# EAGLE design sensor (EAGLE 9.6.2)

## Sheet 1 of 3: COVER
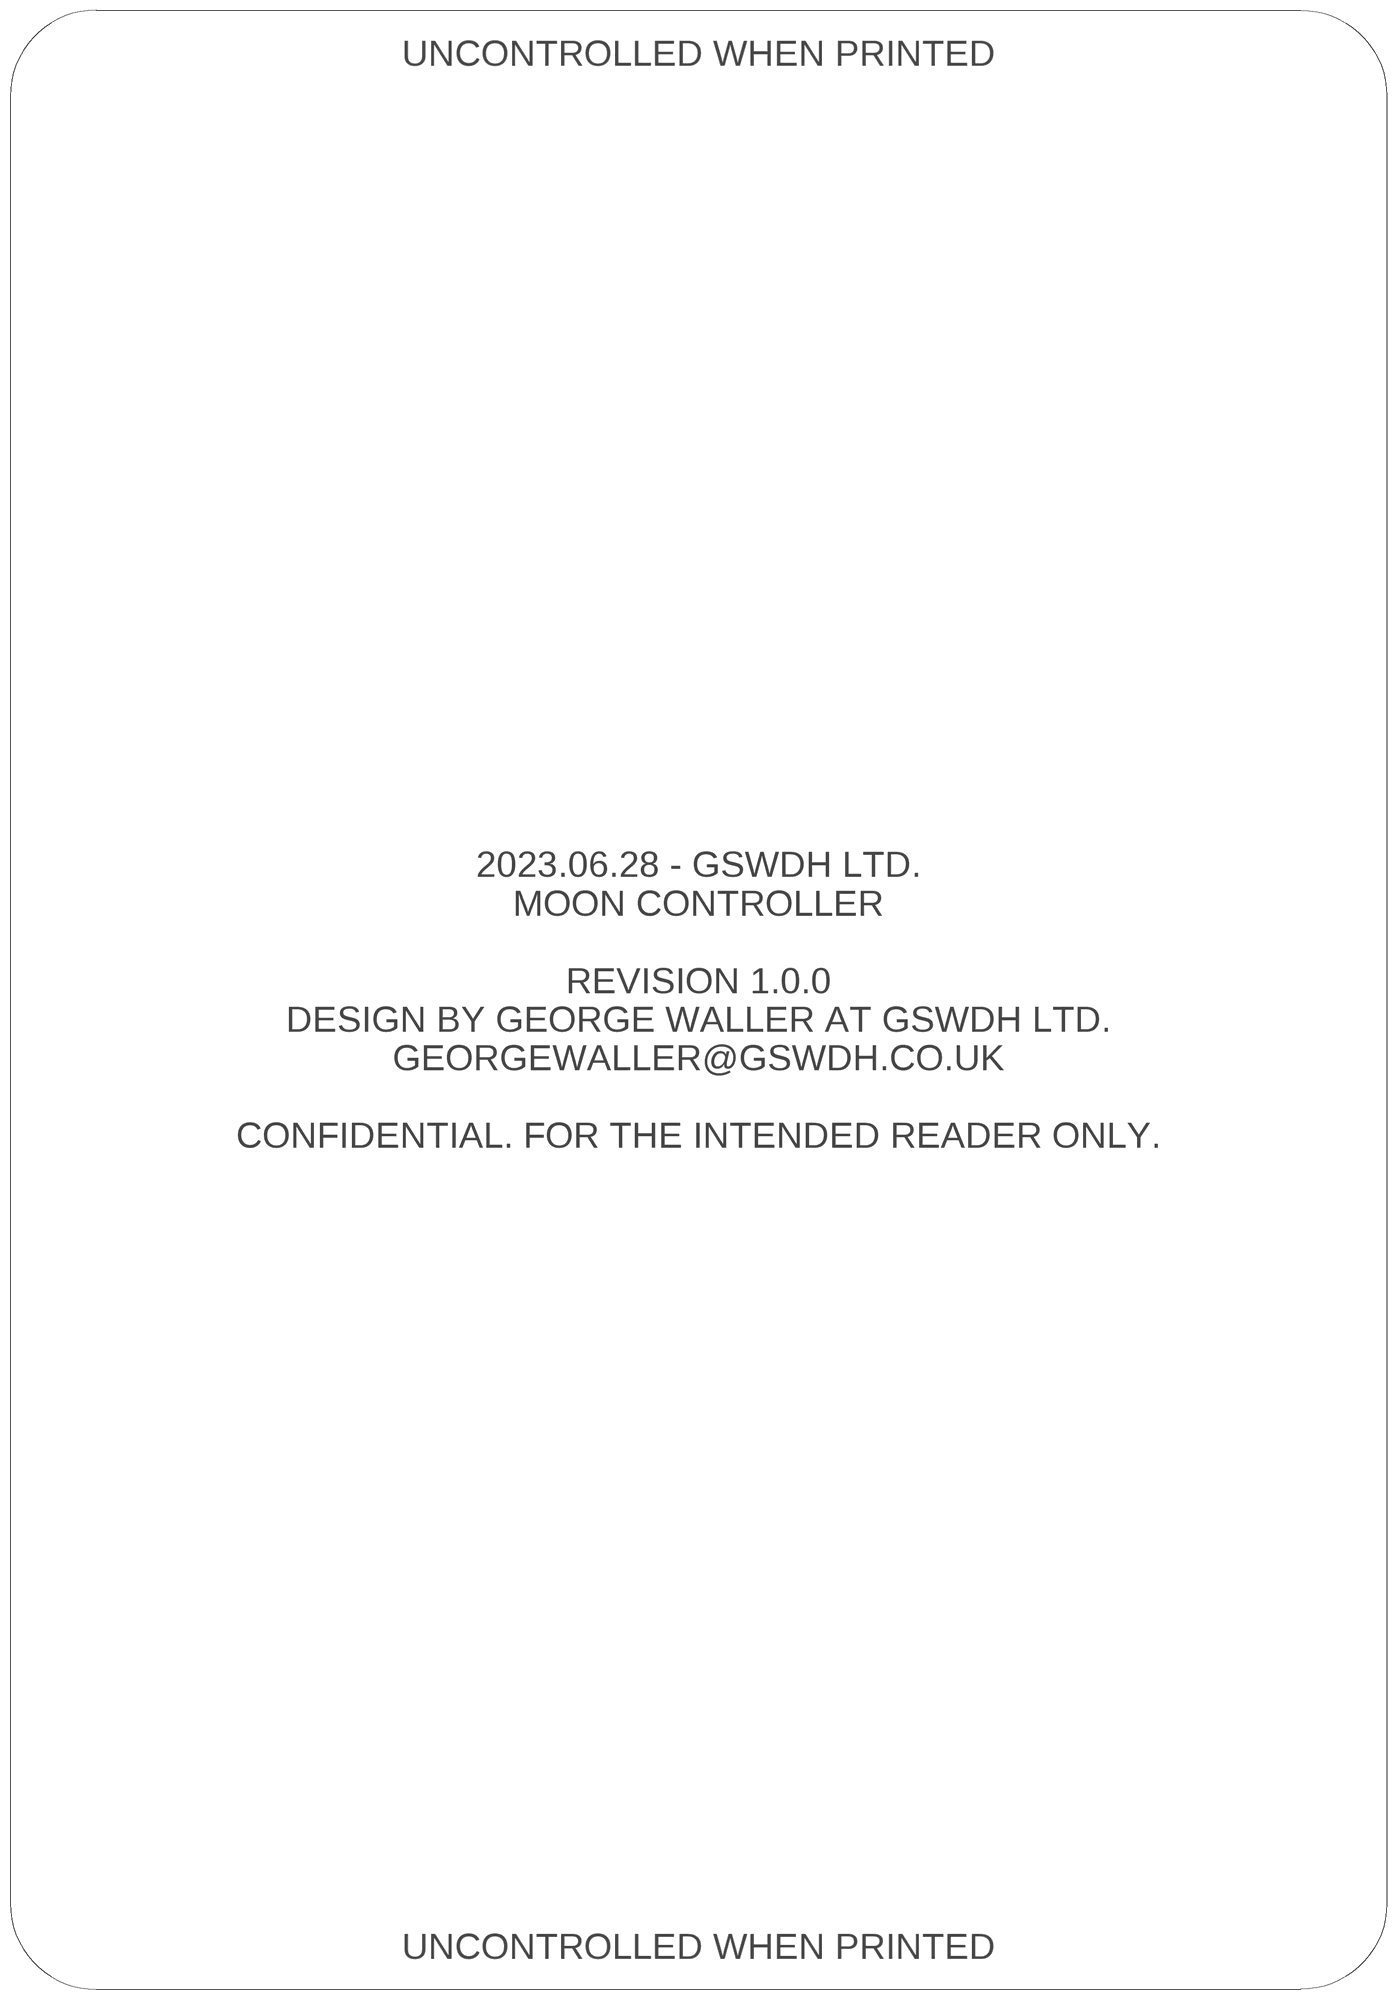
[diagram p0: schematic, sheet 1]

### Notes on the sheet
- UNCONTROLLED WHEN PRINTED
- 2023.06.28 - GSWDH LTD.
  MOON CONTROLLER
  
  REVISION 1.0.0
  DESIGN BY GEORGE WALLER AT GSWDH LTD.
  GEORGEWALLER@GSWDH.CO.UK
  
  CONFIDENTIAL. FOR THE INTENDED READER ONLY.
- UNCONTROLLED WHEN PRINTED

## Sheet 2 of 3: SENSOR
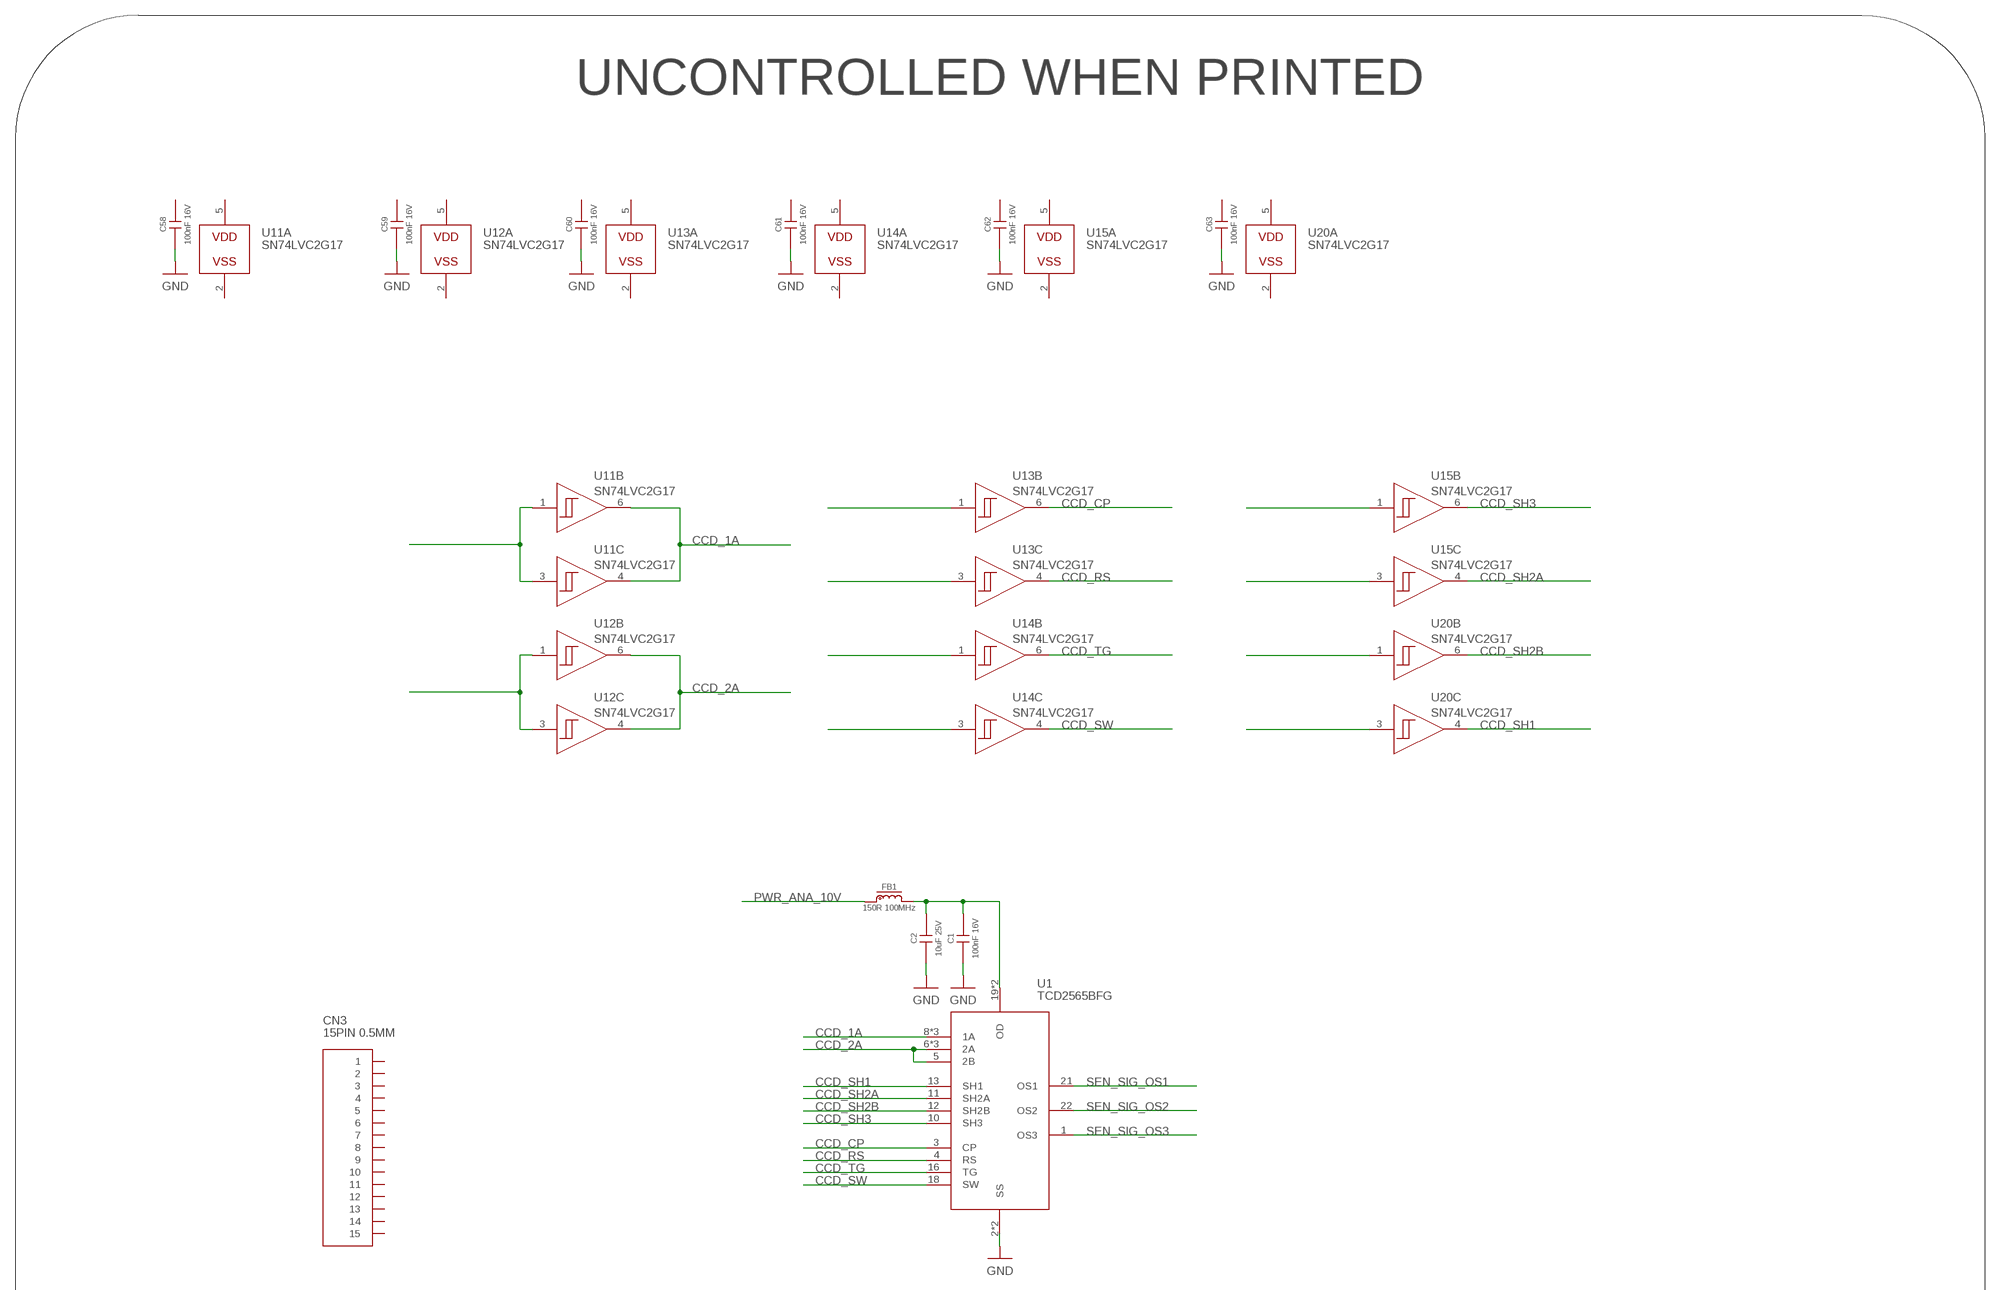
[diagram p1: schematic, sheet 2, part 1 of 2]
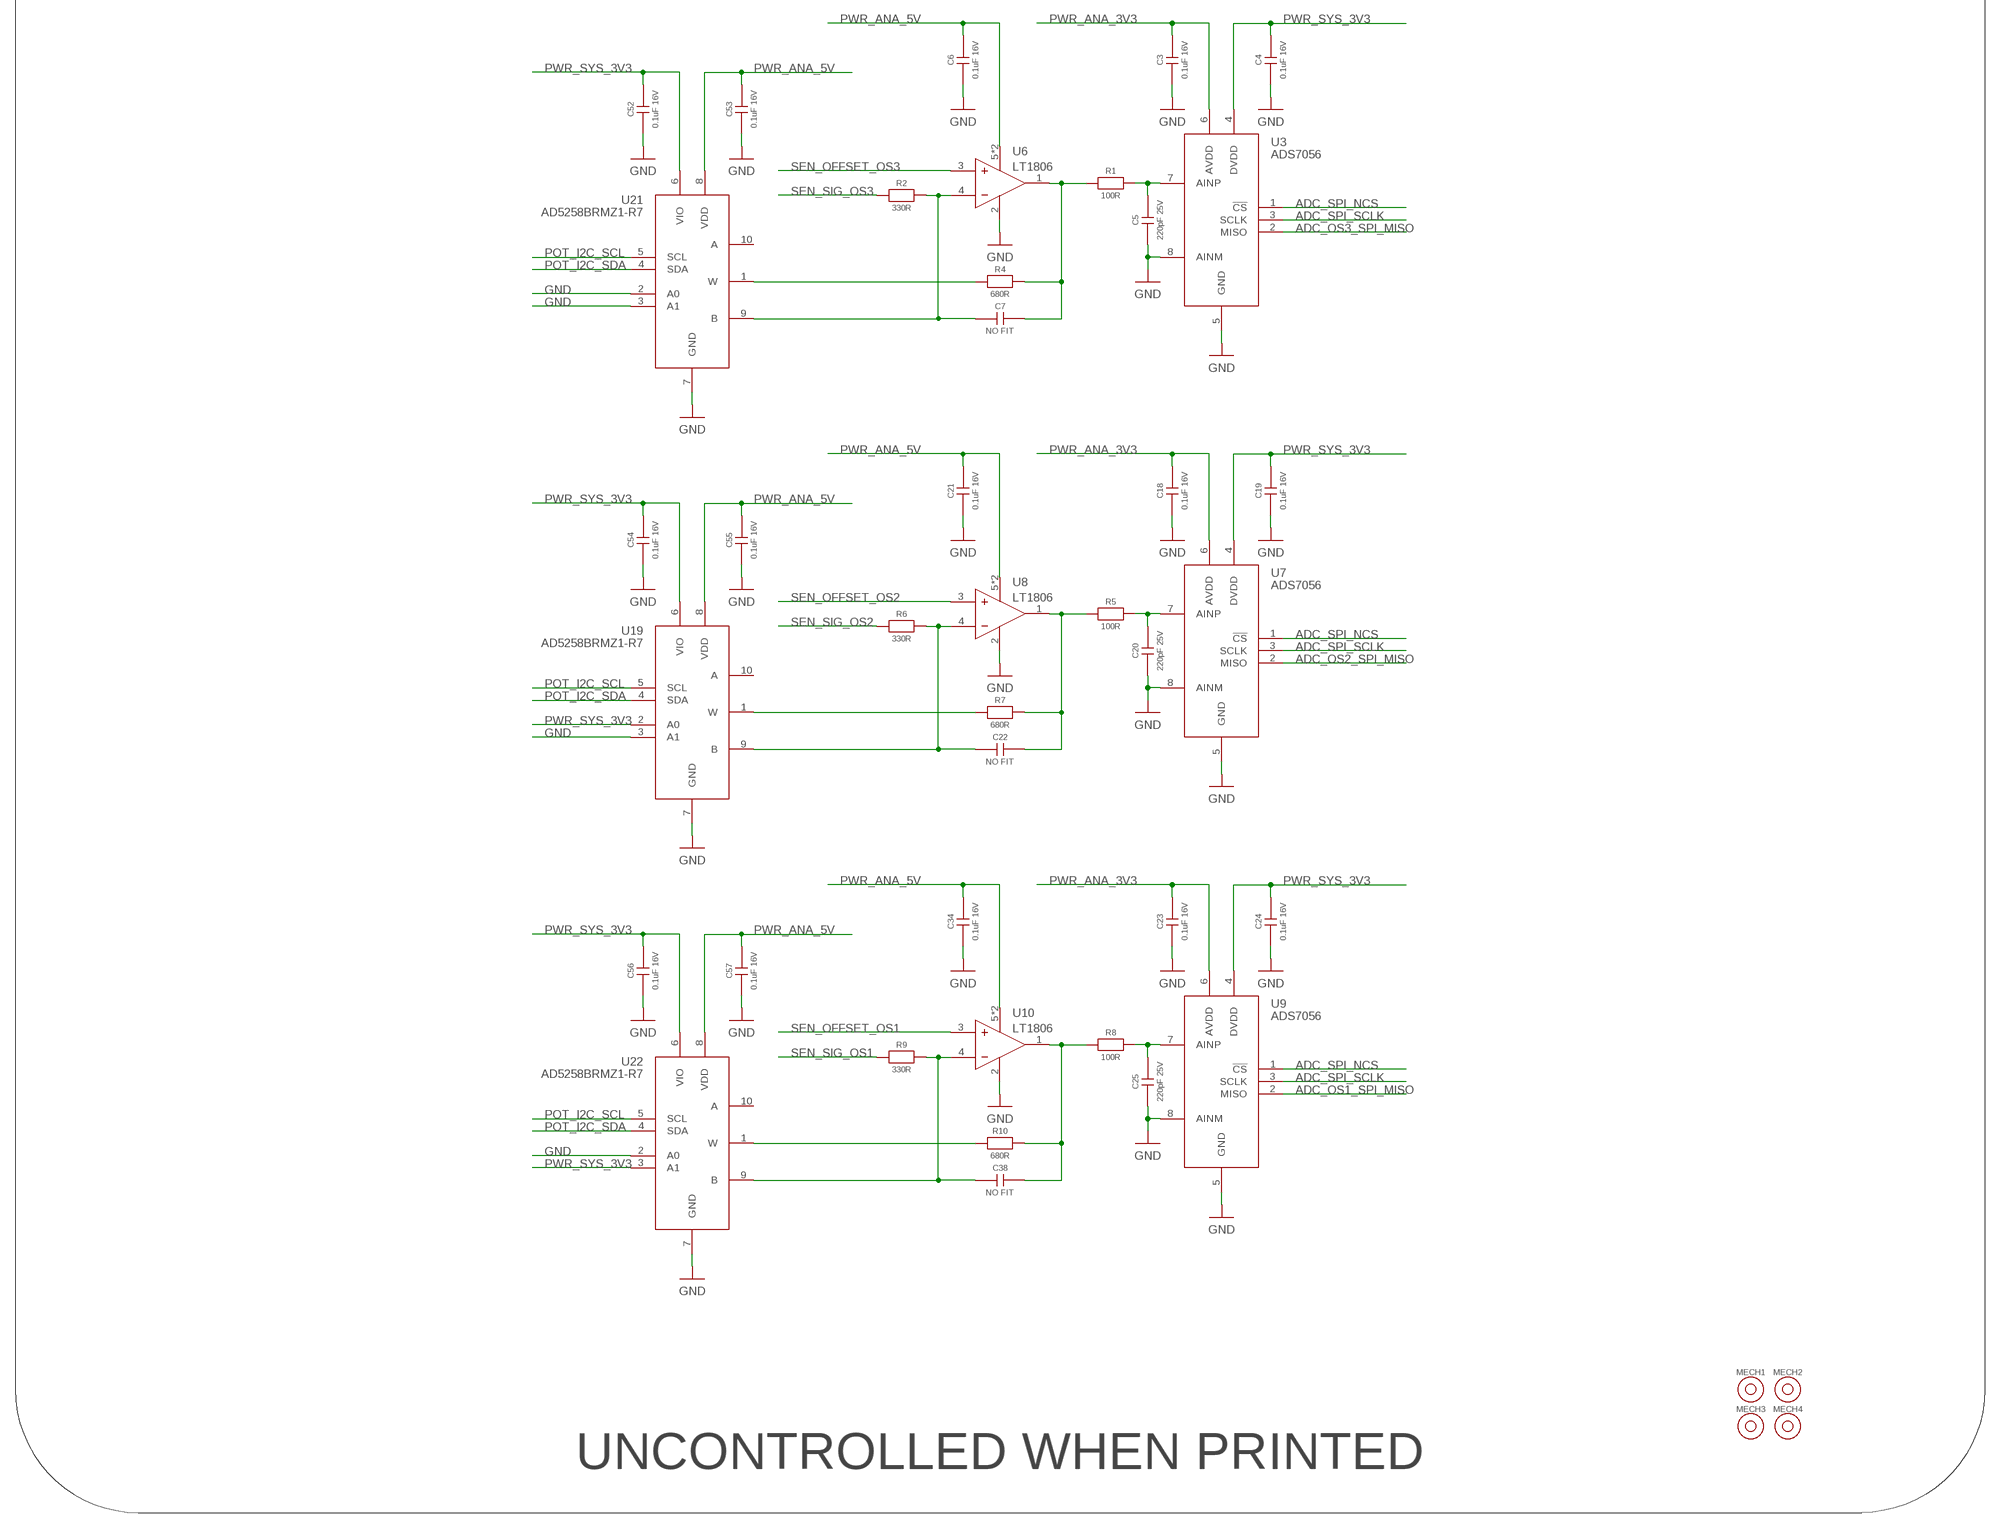
[diagram p2: schematic, sheet 2, part 2 of 2]

### Parts
C1  100nF 16V  CL10B104KO8WPNC  [0603]
C2  10uF 25V  C1206C106K3RACAUTO  [1206]
C3  0.1uF 16V  0402YC104KAT2A  [0402]
C4  0.1uF 16V  0402YC104KAT2A  [0402]
C5  220pF 25V  04023A221FAT2A  [0402]
C6  0.1uF 16V  0402YC104KAT2A  [0402]
C7  NO FIT  C0402C100J3GACAUTO  [0402]
C18  0.1uF 16V  0402YC104KAT2A  [0402]
C19  0.1uF 16V  0402YC104KAT2A  [0402]
C20  220pF 25V  04023A221FAT2A  [0402]
C21  0.1uF 16V  0402YC104KAT2A  [0402]
C22  NO FIT  C0402C100J3GACAUTO  [0402]
C23  0.1uF 16V  0402YC104KAT2A  [0402]
C24  0.1uF 16V  0402YC104KAT2A  [0402]
C25  220pF 25V  04023A221FAT2A  [0402]
C34  0.1uF 16V  0402YC104KAT2A  [0402]
C38  NO FIT  C0402C100J3GACAUTO  [0402]
C52  0.1uF 16V  0402YC104KAT2A  [0402]
C53  0.1uF 16V  0402YC104KAT2A  [0402]
C54  0.1uF 16V  0402YC104KAT2A  [0402]
C55  0.1uF 16V  0402YC104KAT2A  [0402]
C56  0.1uF 16V  0402YC104KAT2A  [0402]
C57  0.1uF 16V  0402YC104KAT2A  [0402]
C58  100nF 16V  CL10B104KO8WPNC  [0603]
C59  100nF 16V  CL10B104KO8WPNC  [0603]
C60  100nF 16V  CL10B104KO8WPNC  [0603]
C61  100nF 16V  CL10B104KO8WPNC  [0603]
C62  100nF 16V  CL10B104KO8WPNC  [0603]
C63  100nF 16V  CL10B104KO8WPNC  [0603]
CN3  15PIN 0.5MM  SFV15R-1STE1HLF  [SFV15R-1STE1HLF]
FB1  150R 100MHz  ILB1206ER151V  [1206]
MECH1  6mm x 3mm  MOUNTHOLE  [MOUNTHOLE_6X3]
MECH2  6mm x 3mm  MOUNTHOLE  [MOUNTHOLE_6X3]
MECH3  6mm x 3mm  MOUNTHOLE  [MOUNTHOLE_6X3]
MECH4  6mm x 3mm  MOUNTHOLE  [MOUNTHOLE_6X3]
R1  100R  RC0402FR-10100RL  [0402]
R2  330R  RC0402FR-07330RL  [0402]
R4  680R  RC0402FR-07680RL  [0402]
R5  100R  RC0402FR-10100RL  [0402]
R6  330R  RC0402FR-07330RL  [0402]
R7  680R  RC0402FR-07680RL  [0402]
R8  100R  RC0402FR-10100RL  [0402]
R9  330R  RC0402FR-07330RL  [0402]
R10  680R  RC0402FR-07680RL  [0402]
U1  TCD2565BFG  [TCD2565BFG]
U3  ADS7056  ADS7056IRUGR  [X2QFN8]
U6  LT1806  LT1806CS6#TRMPBF  [SOT23-6]
U7  ADS7056  ADS7056IRUGR  [X2QFN8]
U8  LT1806  LT1806CS6#TRMPBF  [SOT23-6]
U9  ADS7056  ADS7056IRUGR  [X2QFN8]
U10  LT1806  LT1806CS6#TRMPBF  [SOT23-6]
U11  SN74LVC2G17  SN74LVC2G17DBVR  [SOT23-6]
U12  SN74LVC2G17  SN74LVC2G17DBVR  [SOT23-6]
U13  SN74LVC2G17  SN74LVC2G17DBVR  [SOT23-6]
U14  SN74LVC2G17  SN74LVC2G17DBVR  [SOT23-6]
U15  SN74LVC2G17  SN74LVC2G17DBVR  [SOT23-6]
U19  AD5258BRMZ1-R7  [MSOP10]
U20  SN74LVC2G17  SN74LVC2G17DBVR  [SOT23-6]
U21  AD5258BRMZ1-R7  [MSOP10]
U22  AD5258BRMZ1-R7  [MSOP10]

### Nets
ADC_OS1_SPI_MISO: U9.2(MISO)
ADC_OS2_SPI_MISO: U7.2(MISO)
ADC_OS3_SPI_MISO: U3.2(MISO)
ADC_SPI_NCS: U3.1(!CS) U7.1(!CS) U9.1(!CS)
ADC_SPI_SCLK: U3.3(SCLK) U7.3(SCLK) U9.3(SCLK)
CCD_1A: U1.8(1A) U1.15(1A) U1.17(1A) U11.4(C:Q) U11.6(B:Q)
CCD_2A: U1.5(2B) U1.6(2A) U1.9(2A) U1.14(2A) U12.4(C:Q) U12.6(B:Q)
CCD_CP: U1.3(CP) U13.6(B:Q)
CCD_RS: U1.4(RS) U13.4(C:Q)
CCD_SH1: U1.13(SH1) U20.4(C:Q)
CCD_SH2A: U1.11(SH2A) U15.4(C:Q)
CCD_SH2B: U1.12(SH2B) U20.6(B:Q)
CCD_SH3: U1.10(SH3) U15.6(B:Q)
CCD_SW: U1.18(SW) U14.4(C:Q)
CCD_TG: U1.16(TG) U14.6(B:Q)
GND: C1.1 C2.1 C3.1 C4.1 C5.1 C6.1 C18.1 C19.1 C20.1 C21.1 C23.1 C24.1 C25.1 C34.1 C52.1 C53.1 C54.1 C55.1 C56.1 C57.1 C58.1 C59.1 C60.1 C61.1 C62.1 C63.1 U1.2(SS) U1.7(SS) U3.5(GND) U3.8(AINM) U6.2(V-) U7.5(GND) U7.8(AINM) U8.2(V-) U9.5(GND) U9.8(AINM) U10.2(V-) U19.3(A1) U19.7(GND) U21.2(A0) U21.3(A1) U21.7(GND) U22.2(A0) U22.7(GND) ; also sheet 3
N$1: C1.2 C2.2 FB1.2 U1.19(OD) U1.20(OD)
N$2: C5.2 R1.2 U3.7(AINP)
N$5: C7.2 R1.1 R4.2 U6.1(OUT)
N$6: C7.1 R2.2 U6.4(-) U21.9(B)
N$7: U11.1(B:A) U11.3(C:A)
N$9: R7.1 U19.1(W)
N$10: R4.1 U21.1(W)
N$11: U12.1(B:A) U12.3(C:A)
N$12: R10.1 U22.1(W)
N$13: U13.1(B:A)
N$14: C38.1 R9.2 U10.4(-) U22.9(B)
N$15: U13.3(C:A)
N$16: U14.1(B:A)
N$17: U14.3(C:A)
N$19: C20.2 R5.2 U7.7(AINP)
N$20: C22.2 R5.1 R7.2 U8.1(OUT)
N$21: C22.1 R6.2 U8.4(-) U19.9(B)
N$22: C25.2 R8.2 U9.7(AINP)
N$23: C38.2 R8.1 R10.2 U10.1(OUT)
N$39: U15.1(B:A)
N$40: U15.3(C:A)
N$41: U20.1(B:A)
N$42: U20.3(C:A)
POT_I2C_SCL: U19.5(SCL) U21.5(SCL) U22.5(SCL)
POT_I2C_SDA: U19.4(SDA) U21.4(SDA) U22.4(SDA)
PWR_ANA_3V3: C3.2 C18.2 C23.2 U3.6(AVDD) U7.6(AVDD) U9.6(AVDD)
PWR_ANA_5V: C6.2 C21.2 C34.2 C53.2 C55.2 C57.2 U6.5(V+) U6.6(V+) U8.5(V+) U8.6(V+) U10.5(V+) U10.6(V+) U19.8(VDD) U21.8(VDD) U22.8(VDD)
PWR_ANA_10V: FB1.1
PWR_SYS_3V3: C4.2 C19.2 C24.2 C52.2 C54.2 C56.2 U3.4(DVDD) U7.4(DVDD) U9.4(DVDD) U19.2(A0) U19.6(VIO) U21.6(VIO) U22.3(A1) U22.6(VIO)
SEN_OFFSET_OS1: U10.3(+)
SEN_OFFSET_OS2: U8.3(+)
SEN_OFFSET_OS3: U6.3(+)
SEN_SIG_OS1: R9.1 U1.21(OS1)
SEN_SIG_OS2: R6.1 U1.22(OS2)
SEN_SIG_OS3: R2.1 U1.1(OS3)
Unconnected: C58.2 C59.2 C60.2 C61.2 C62.2 C63.2 CN3.1 CN3.2 CN3.3 CN3.4 CN3.5 CN3.6 CN3.7 CN3.8 CN3.9 CN3.10 CN3.11 CN3.12 CN3.13 CN3.14 CN3.15 U11.2(A:GND) U11.5(A:V+) U12.2(A:GND) U12.5(A:V+) U13.2(A:GND) U13.5(A:V+) U14.2(A:GND) U14.5(A:V+) U15.2(A:GND) U15.5(A:V+) U19.10(A) U20.2(A:GND) U20.5(A:V+) U21.10(A) U22.10(A)

### Notes on the sheet
- UNCONTROLLED WHEN PRINTED
- UNCONTROLLED WHEN PRINTED

## Sheet 3 of 3: POWER
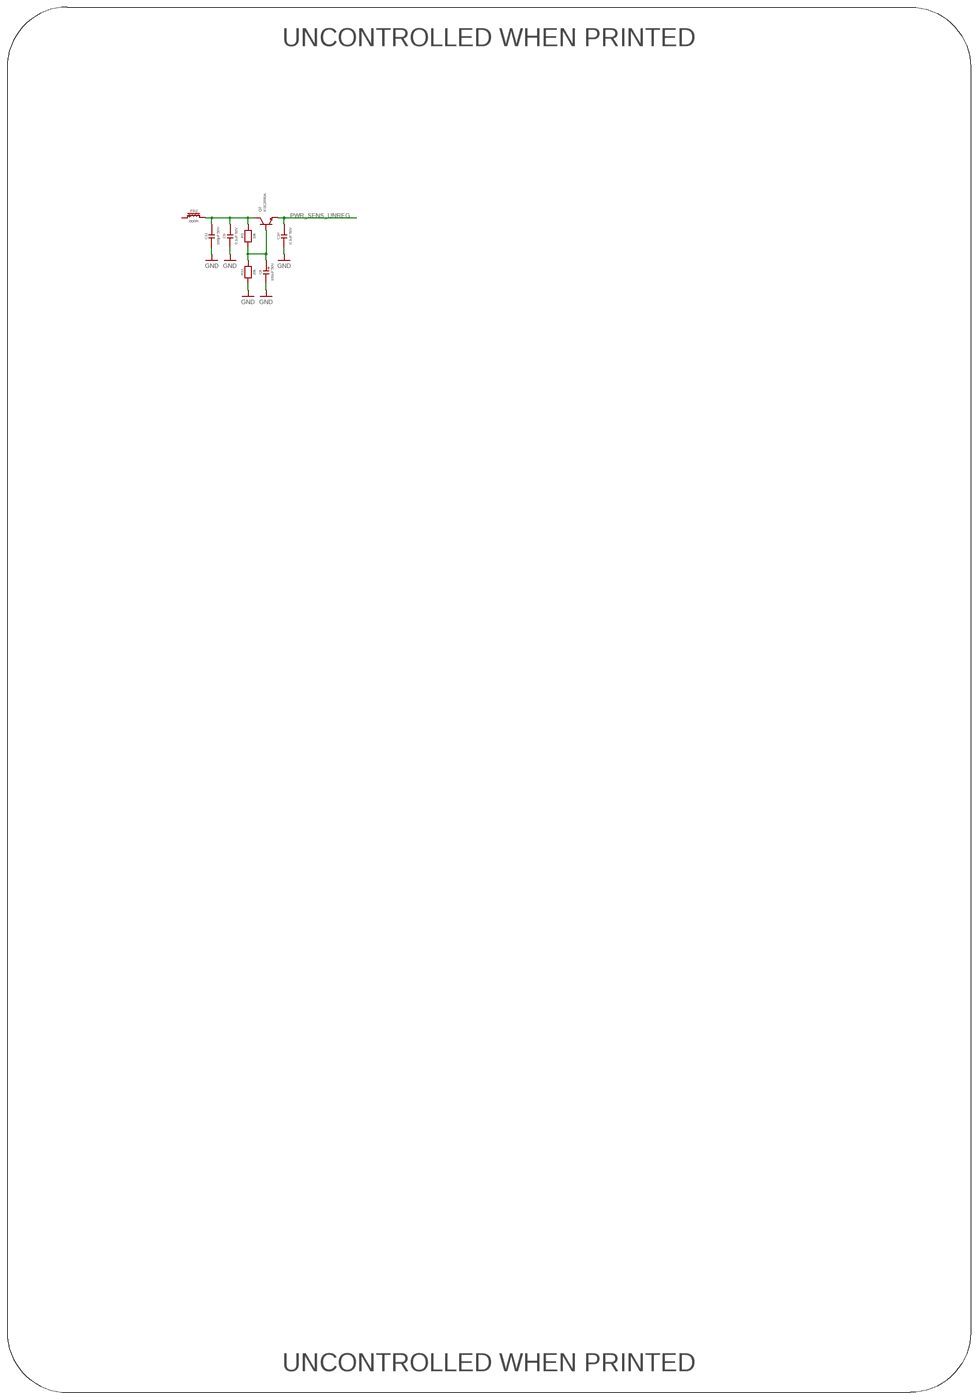
[diagram p3: schematic, sheet 3, overview]
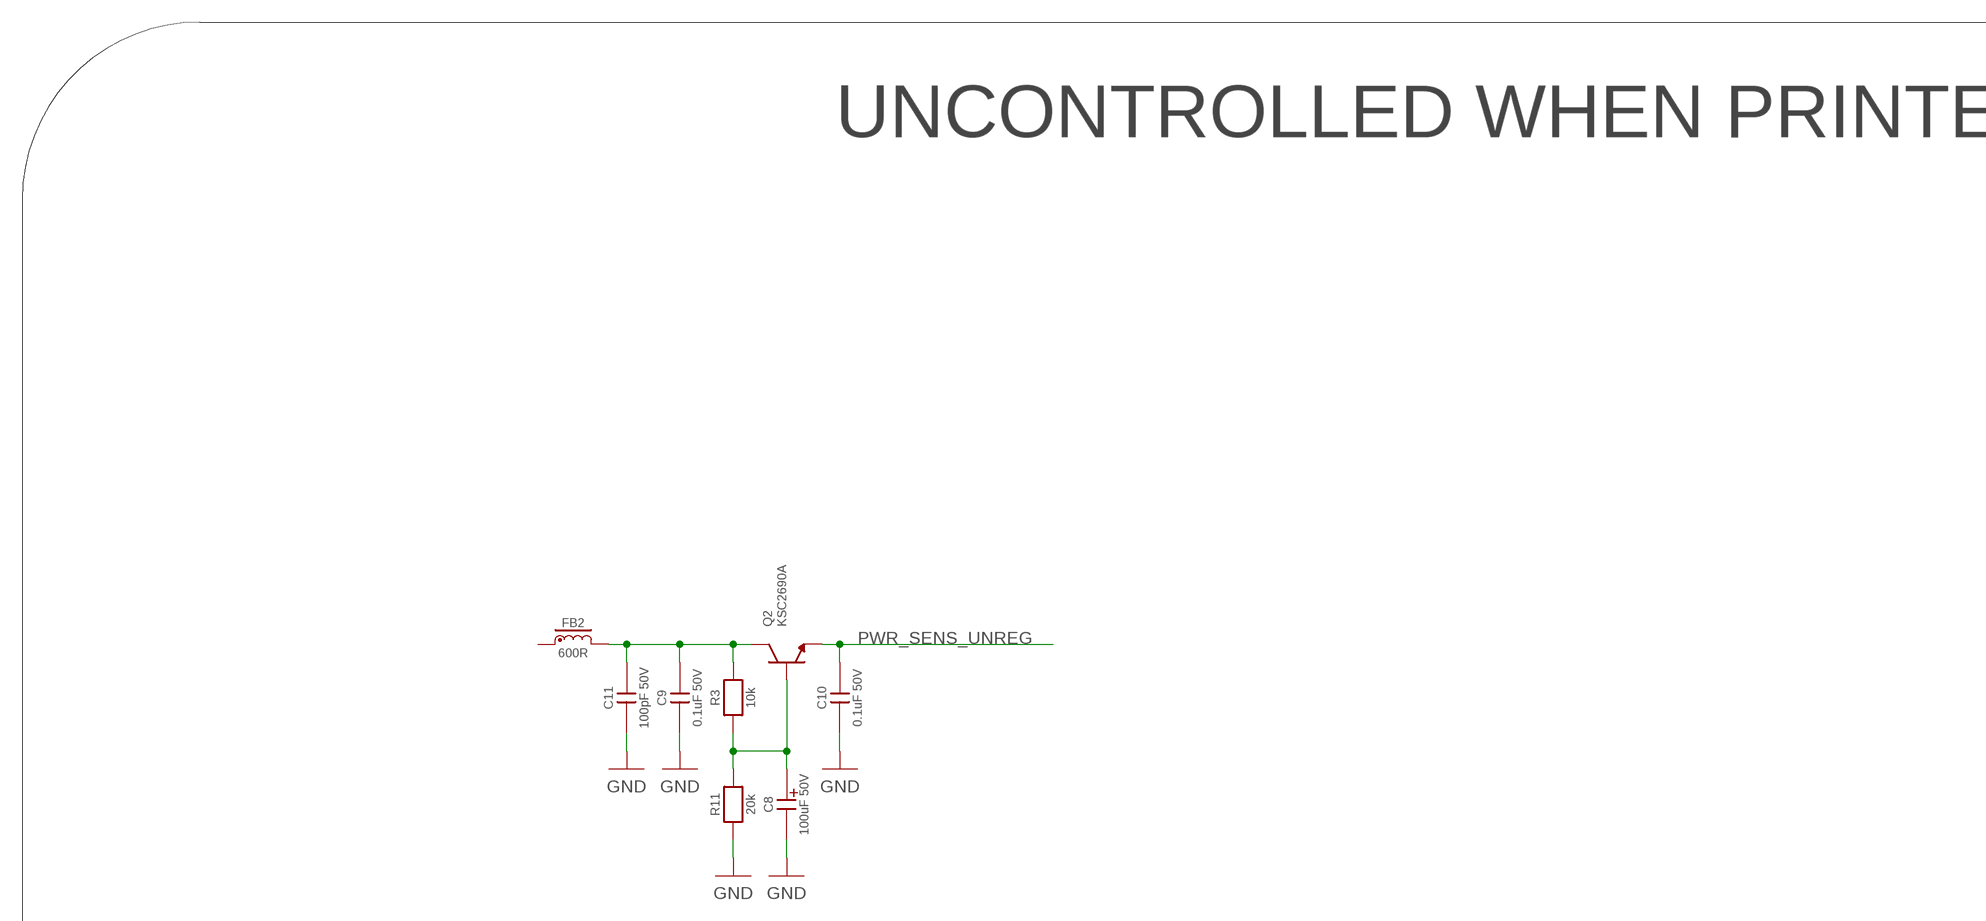
[diagram p4: schematic, sheet 3, part 1 of 4]
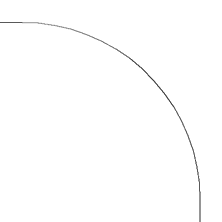
[diagram p5: schematic, sheet 3, part 2 of 4]
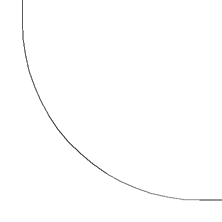
[diagram p6: schematic, sheet 3, part 3 of 4]
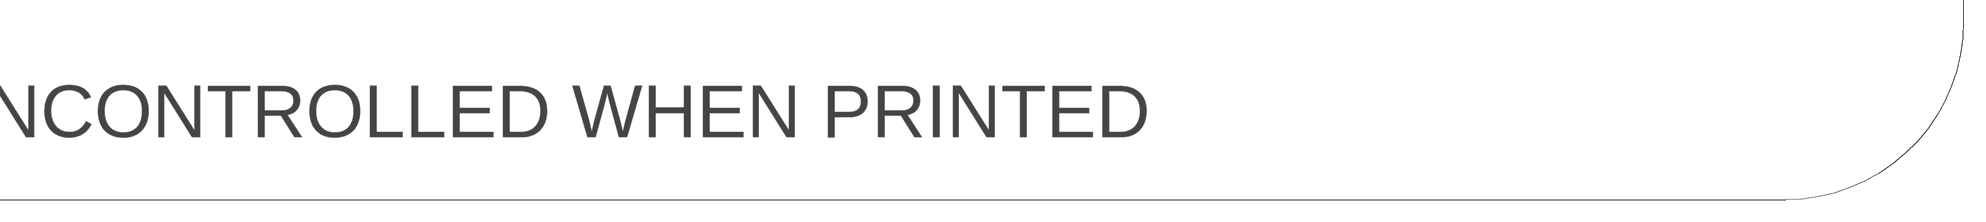
[diagram p7: schematic, sheet 3, part 4 of 4]

### Parts
C8  100uF 50V  107CKR050M  [8MM_RADIAL_3.5MM_PITCH]
C9  0.1uF 50V  06035C104JAT2A  [0603]
C10  0.1uF 50V  06035C104JAT2A  [0603]
C11  100pF 50V  06035A101J4T4A  [0603]
FB2  600R  742792651  [0603]
Q2  KSC2690A  KSC2690AV  [TO126V]
R3  10k  CRCW060310K0FKTA  [0603]
R11  20k  CRCW060320K0FKEA  [0603]

### Nets
GND: C8.N(K) C9.1 C10.1 C11.1 R11.1 ; also sheet 2
N$3: C9.2 C11.2 FB2.2 Q2.2(C) R3.2
N$4: C8.P(A) Q2.3(B) R3.1 R11.2
PWR_SENS_UNREG: C10.2 Q2.1(E)
Unconnected: FB2.1

### Notes on the sheet
- UNCONTROLLED WHEN PRINTED
- UNCONTROLLED WHEN PRINTED

## Library data of the parts
C1 C58-C63 = CAPACITORS:CL10B104KO8WPNC: 100nF 16V X7R 10% 0603 MLCC; DIGIKEY: 1276-6582-1-ND; HEIGHT: 1; PRICE_PER: 0.08
C2 = c_1206:C1206C106K3RACAUTO: 10000000 25V 10µF ±10% X7R 1206; DIGIKEY: 399-15728-1-ND; HEIGHT: -; MANUFACTURER: KEMET; PRICE_PER: 0.60000; STOCK: 3355; TEMP_CO: X7R; TOLERANCE: ±10%; VOLTAGE: 25V
C3 C4 C6 C18 C19 C21 C23 C24 C34 C52-C57 = c_0402:0402YC104KAT2A: 100000 16V 0.1µF ±10% X7R 0402; DIGIKEY: 478-7888-1-ND; HEIGHT: -; MANUFACTURER: AVX Corporation; PRICE_PER: 0.07000; STOCK: 386465; TEMP_CO: X7R; TOLERANCE: ±10%; VOLTAGE: 16V
C5 C20 C25 = c_0402:04023A221FAT2A: 220 25V 220pF ±1% C0G, NP0 0402; DIGIKEY: 478-10077-1-ND; HEIGHT: -; MANUFACTURER: AVX Corporation; PRICE_PER: 0.27000; STOCK: 6877; TEMP_CO: C0G, NP0; TOLERANCE: ±1%; VOLTAGE: 25V
C7 C22 C38 = c_0402:C0402C100J3GACAUTO: 10 25V 10pF ±5% C0G, NP0 0402; DIGIKEY: 399-19356-1-ND; HEIGHT: -; MANUFACTURER: KEMET; PRICE_PER: 0.07000; STOCK: 1725; TEMP_CO: C0G, NP0; TOLERANCE: ±5%; VALUE: 10pF 25V; VOLTAGE: 25V
C8 = CAPACITORS:107CKR050M: 100uF 50V Electrolytic 20% 8mm radial.; DIGIKEY: 1572-1044-ND; HEIGHT: 14; PRICE_PER: 0.223
C9 C10 = c_0603:06035C104JAT2A: 100000 50V 0.1µF ±5% X7R 0603; DIGIKEY: 478-5778-1-ND; HEIGHT: -; MANUFACTURER: AVX Corporation; PRICE_PER: 0.07000; STOCK: 883194; TEMP_CO: X7R; TOLERANCE: ±5%; VOLTAGE: 50V
C11 = c_0603:06035A101J4T4A: 100 50V 100pF ±5% C0G, NP0 0603; DIGIKEY: 478-06035A101J4T4ACT-ND; HEIGHT: -; MANUFACTURER: AVX Corporation; PRICE_PER: 0.13000; STOCK: 29039; TEMP_CO: C0G, NP0; TOLERANCE: ±5%; VOLTAGE: 50V
CN3 = CONNECTORs:SFV15R-1STE1HLF: 15 Position FFC, FPC Connector Contacts, Bottom 0.020" (0.50mm) Surface Mount, Right Angle; DIGIKEY: 609-4311-1-ND; HEIGHT: 1.8; PRICE_PER: 0.46
FB1 = INDUCTORS:ILB1206ER151V: Ferrite bead, 100MHz, 150R, 0.8A, 1206; DIGIKEY: 541-2281-1-ND; HEIGHT: 1.5; PRICE_PER: 0.14
FB2 = INDUCTORS:742792651: Ferrite Bead 600R at 100MHz 0603.; DIGIKEY: 732-1593-1-ND; HEIGHT: 1; PRICE_PER: 0.13
MECH1-MECH4 = MISC:MOUNTHOLE: Mechanical mounting hole.
Q2 = TRANSISTORs:KSC2690A: Bipolar (BJT) Single Transistor, NPN, 160 V, 155 MHz, 20 W, 1.2 A, 160 hFE; FARNELL: 2453953; PRICE_PER: 0.536
R1 R5 R8 = r_0402:RC0402FR-10100RL: 100 100 Ohms 0402 ±1% 0.063W, 1/16W thick film resistor.; DIGIKEY: 13-RC0402FR-10100RLCT-ND; HEIGHT: 0.4; PRICE_PER: 0.08
R2 R6 R9 = r_0402:RC0402FR-07330RL: 330 330 Ohms 0402 ±1% 0.063W, 1/16W thick film resistor.; DIGIKEY: 311-330LRCT-ND; HEIGHT: 0.4; PRICE_PER: 0.08
R3 = r_0603:CRCW060310K0FKTA: 10000 ±1% 10k Thick Film 0.1W, 1/10W 0603; DIGIKEY: 541-2980-1-ND; HEIGHT: 1; MANUFACTURER: Vishay Dale; POWER: 0.1W, 1/10W; PRICE_PER: 0.12000; STOCK: 50797; TOLERANCE: ±1%
R4 R7 R10 = r_0402:RC0402FR-07680RL: 680 680 Ohms 0402 ±1% 0.063W, 1/16W thick film resistor.; DIGIKEY: 311-680LRCT-ND; HEIGHT: 0.4; PRICE_PER: 0.08
R11 = r_0603:CRCW060320K0FKEA: 20000 ±1% 20k Thick Film 0.1W, 1/10W 0603; DIGIKEY: 541-20.0KHCT-ND; HEIGHT: 1; MANUFACTURER: Vishay Dale; POWER: 0.1W, 1/10W; PRICE_PER: 0.07000; STOCK: 25018; TOLERANCE: ±1%
U1 = ICs:TCD2565BFG: Highly sensitive and low dark current 5400 pixels × 4 line (RGBM) CCD color image sensor.; HEIGHT: 3.5; MOUSER: 757-TCD2565BFGZTC; PRICE_PER: 48.81
U3 U7 U9 = ICs:ADS7056IRUGR: ADS7056 Ultra-Low Power, Ultra-Small Size, 14-Bit, High-Speed SAR ADC; DIGIKEY: 296-47123-1-ND; HEIGHT: 0.5; PRICE_PER: 5.22
U6 U8 U10 = ICs:LT1806: 325MHz, Single, Rail-to-Rail Input and Output, Low Distortion, Low Noise Precision Op Amps; DIGIKEY: 505-LT1806CS6#TRMPBFCT-ND; HEIGHT: 1; PRICE_PER: 4.95
U11-U15 U20 = ICs:SN74LVC2G17: Buffer, Non-Inverting 2 Element 1 Bit per Element Push-Pull Output SOT-23-6; DIGIKEY: 296-SN74LVC2G17DBVRCT-ND; HEIGHT: 1; PRICE_PER: 0.33
U19 U21 U22 = ICs:AD5258: Digital Potentiometer 1k Ohm 1 Circuit 64 Taps I2C Interface 10-MSOP; DIGIKEY: AD5258BRMZ1-R7CT-ND; HEIGHT: 1; PRICE_PER: 1.86

## Board
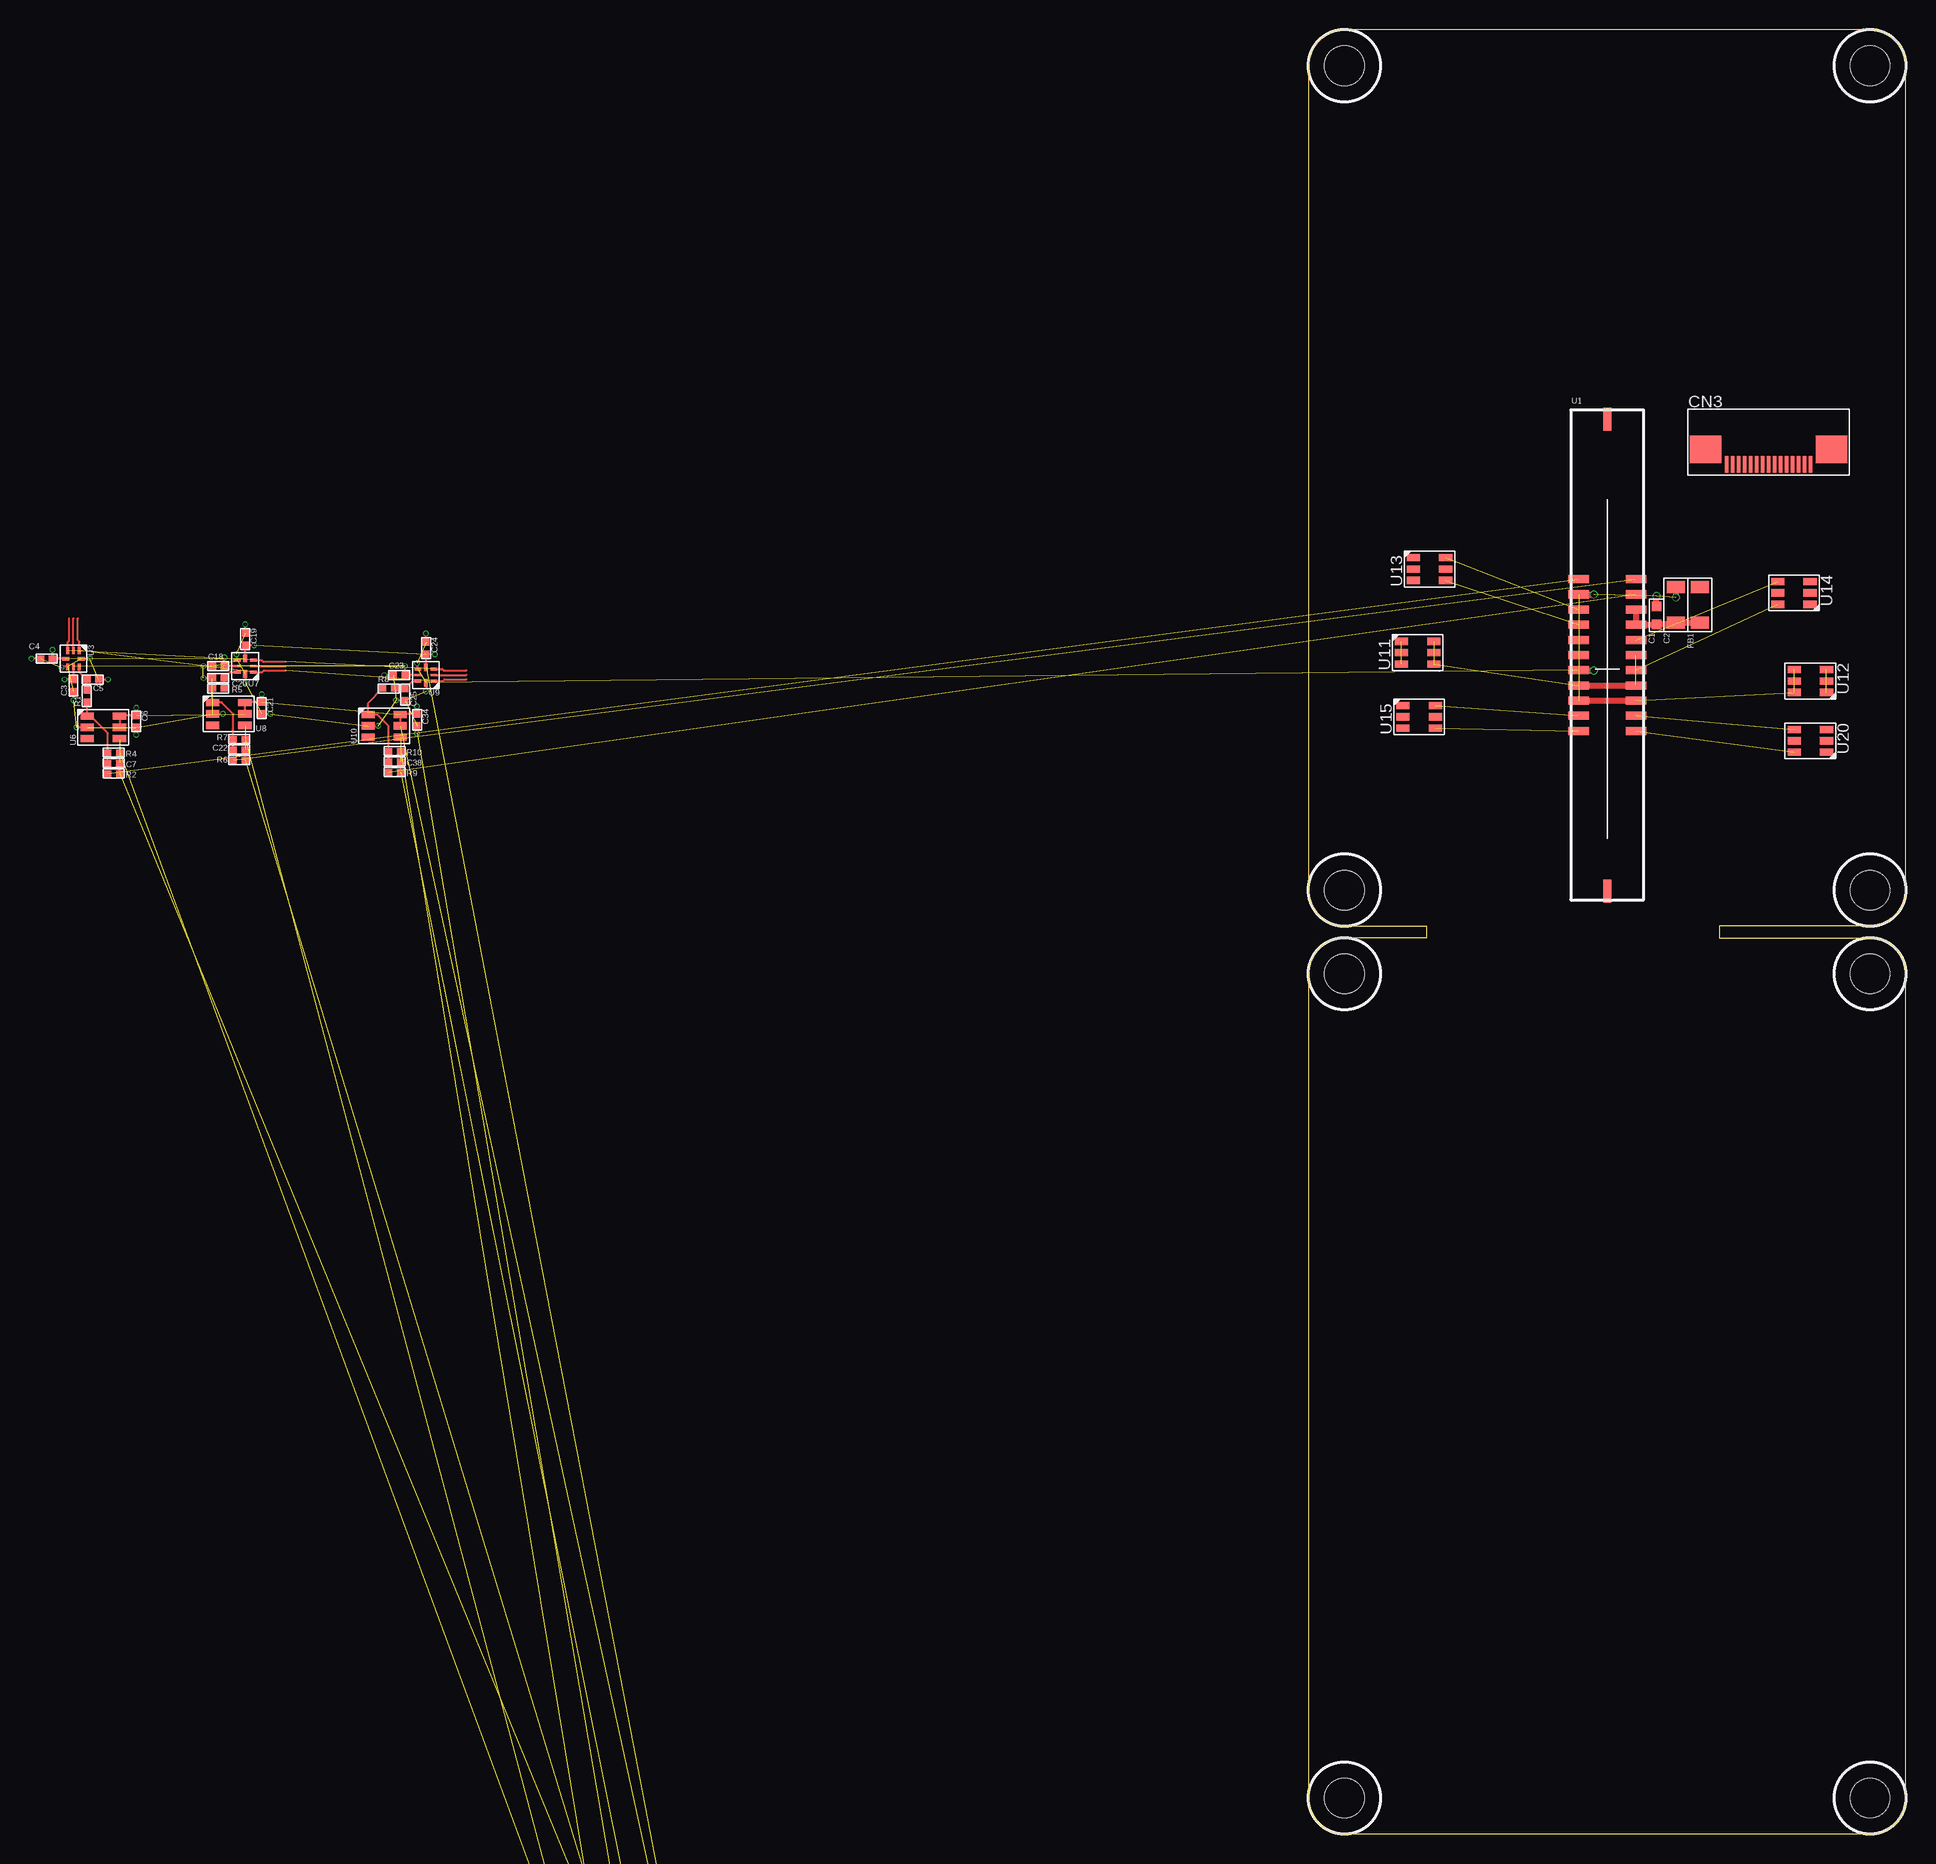
[diagram p8: board, top side]
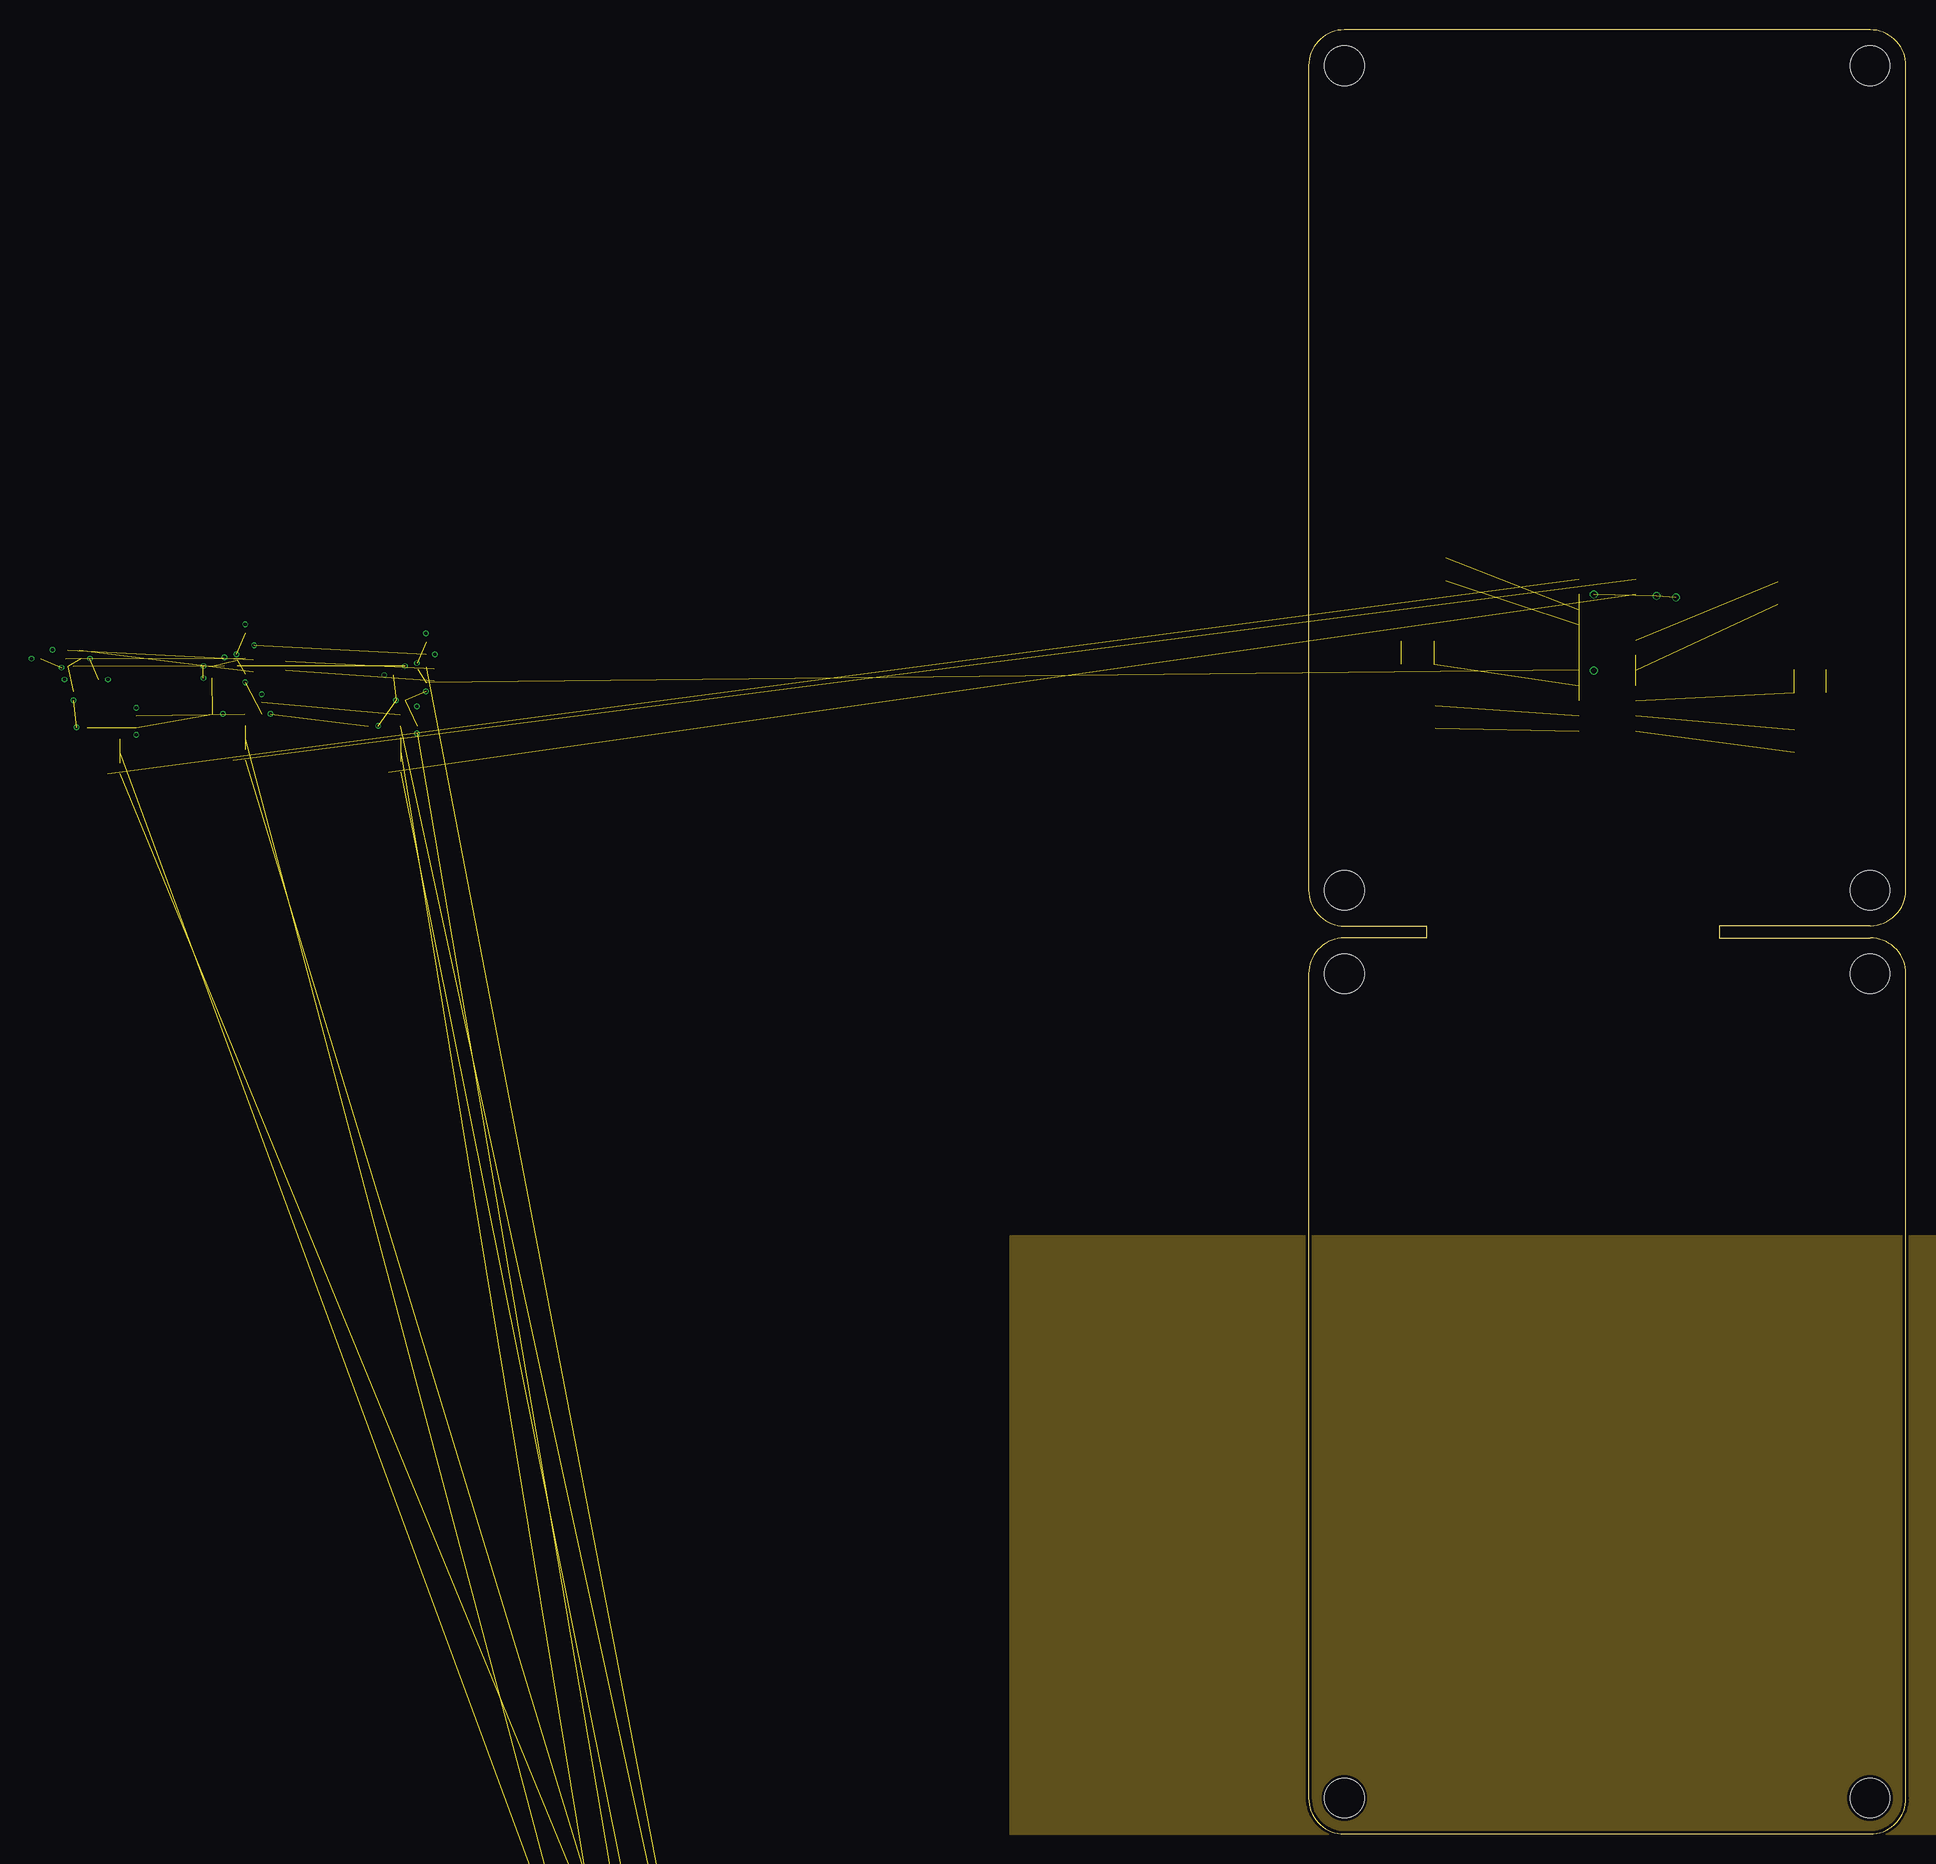
[diagram p9: board, inner layer GND]
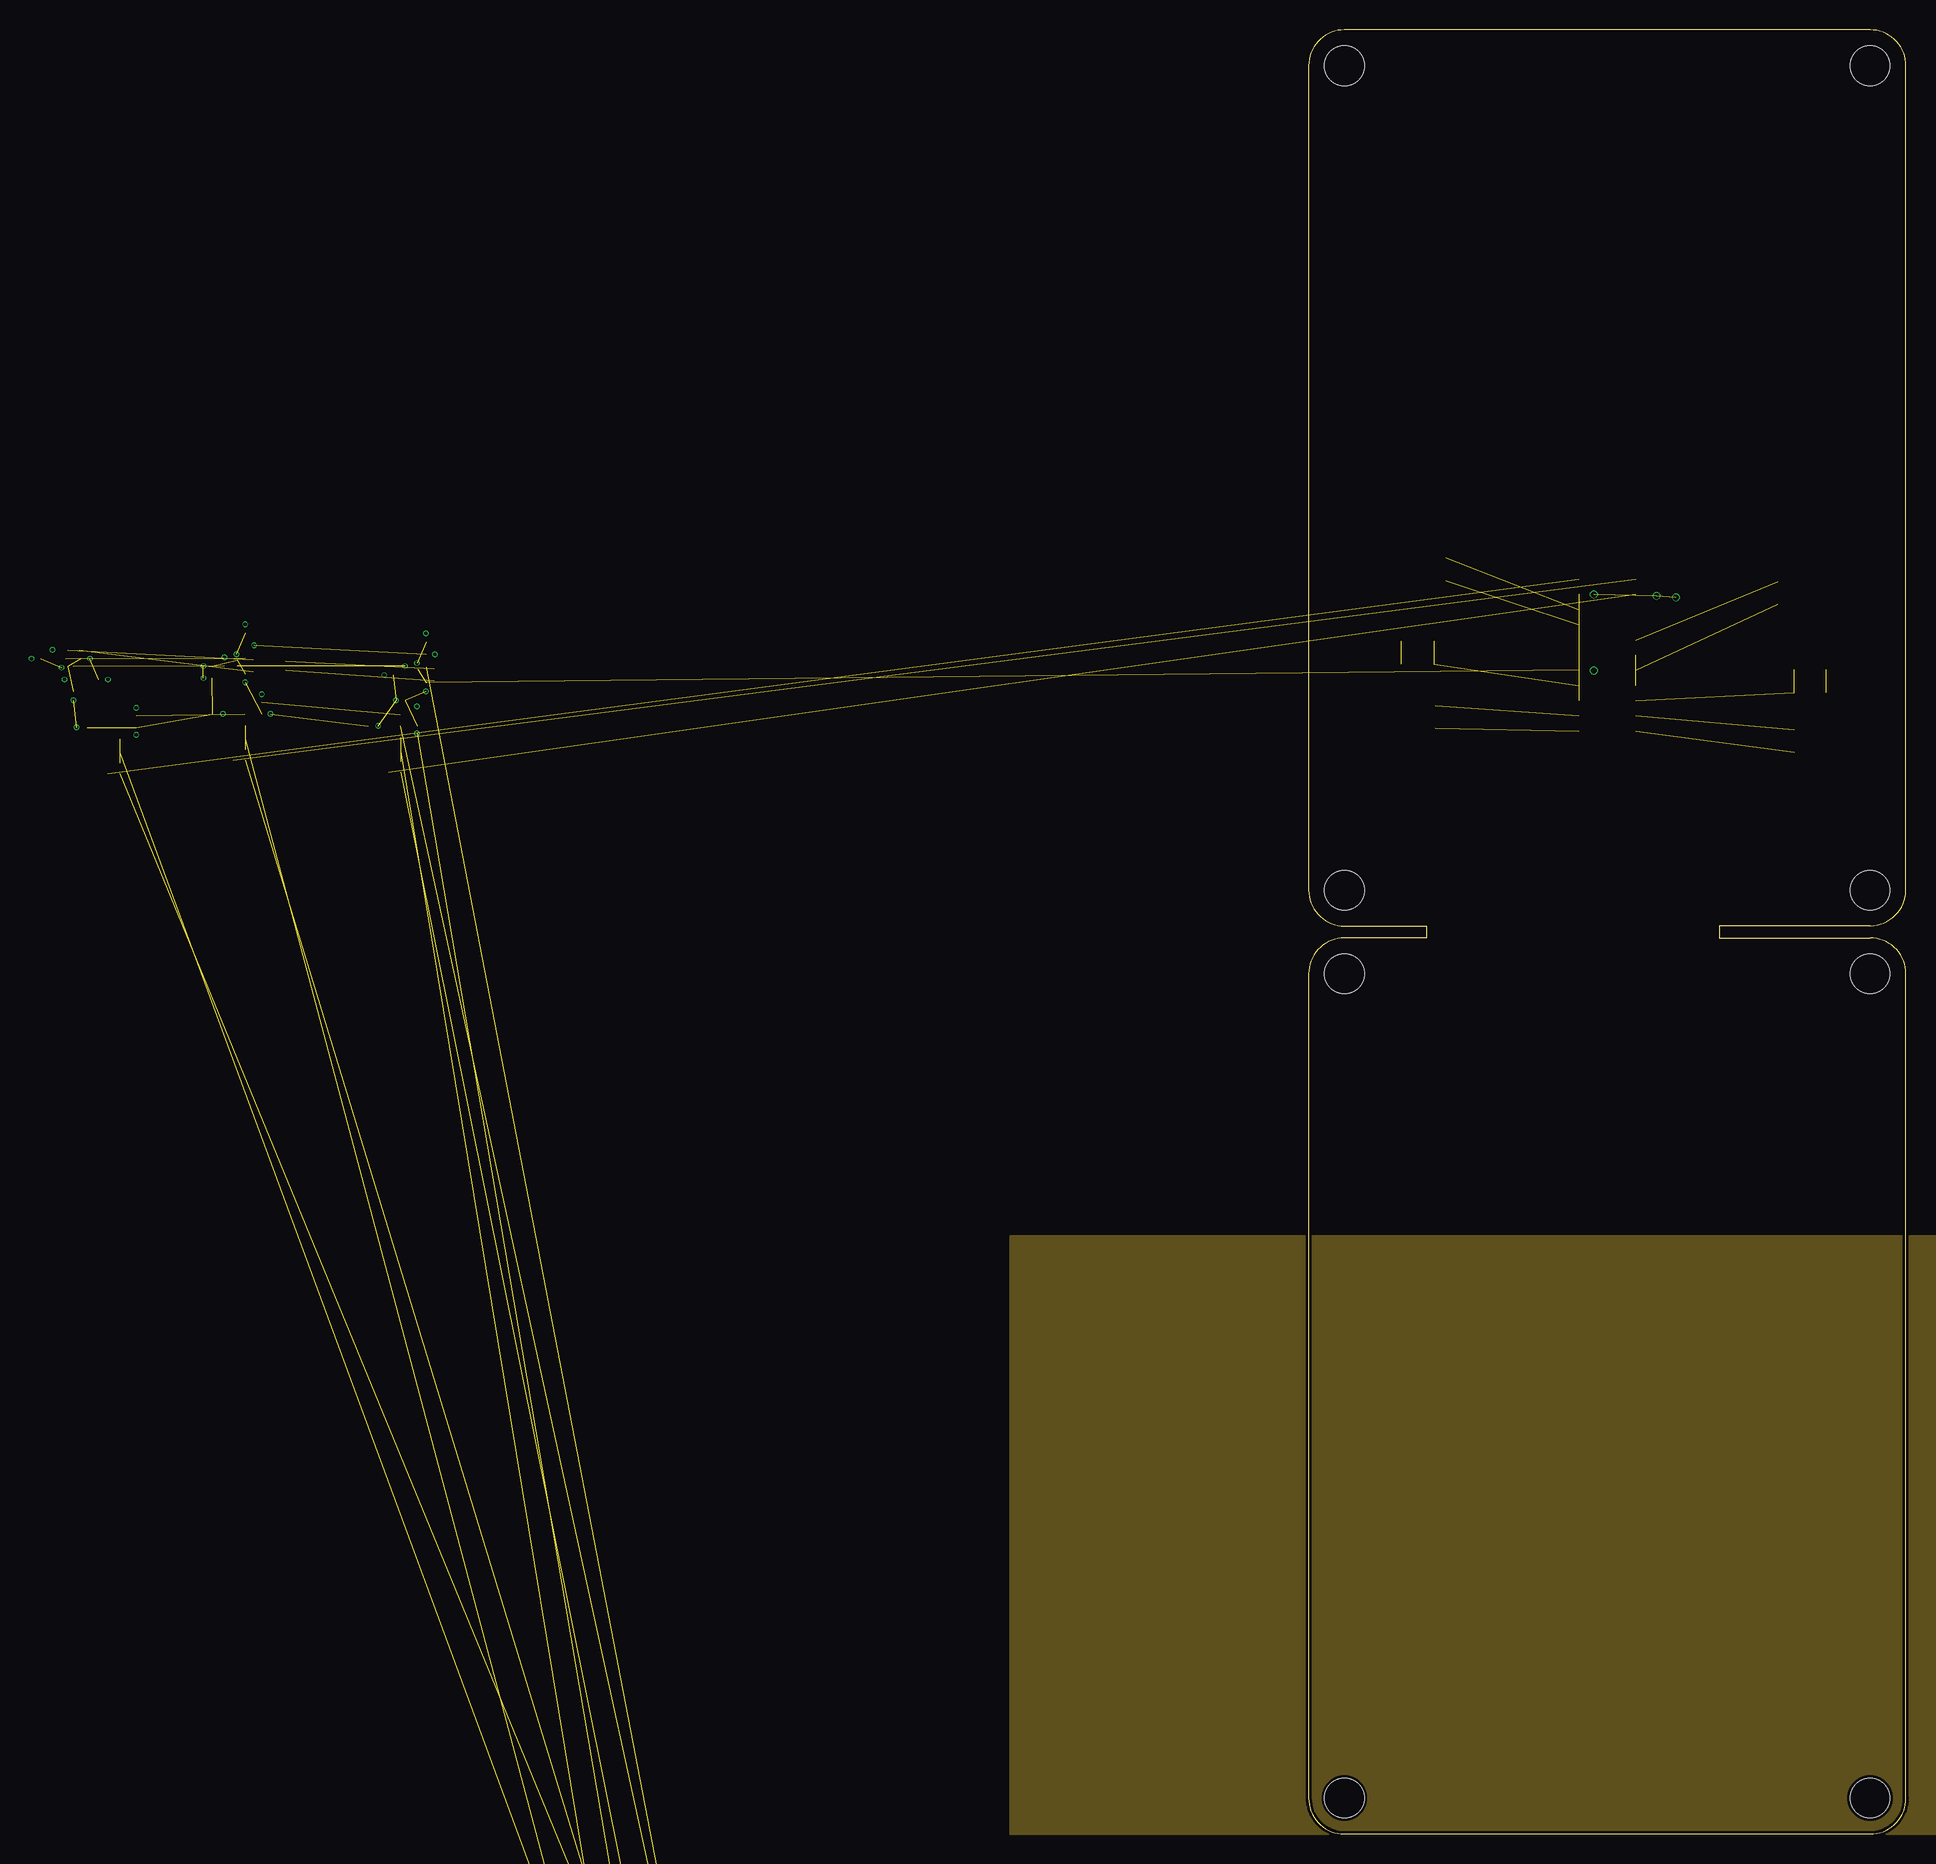
[diagram p10: board, inner layer PWR]
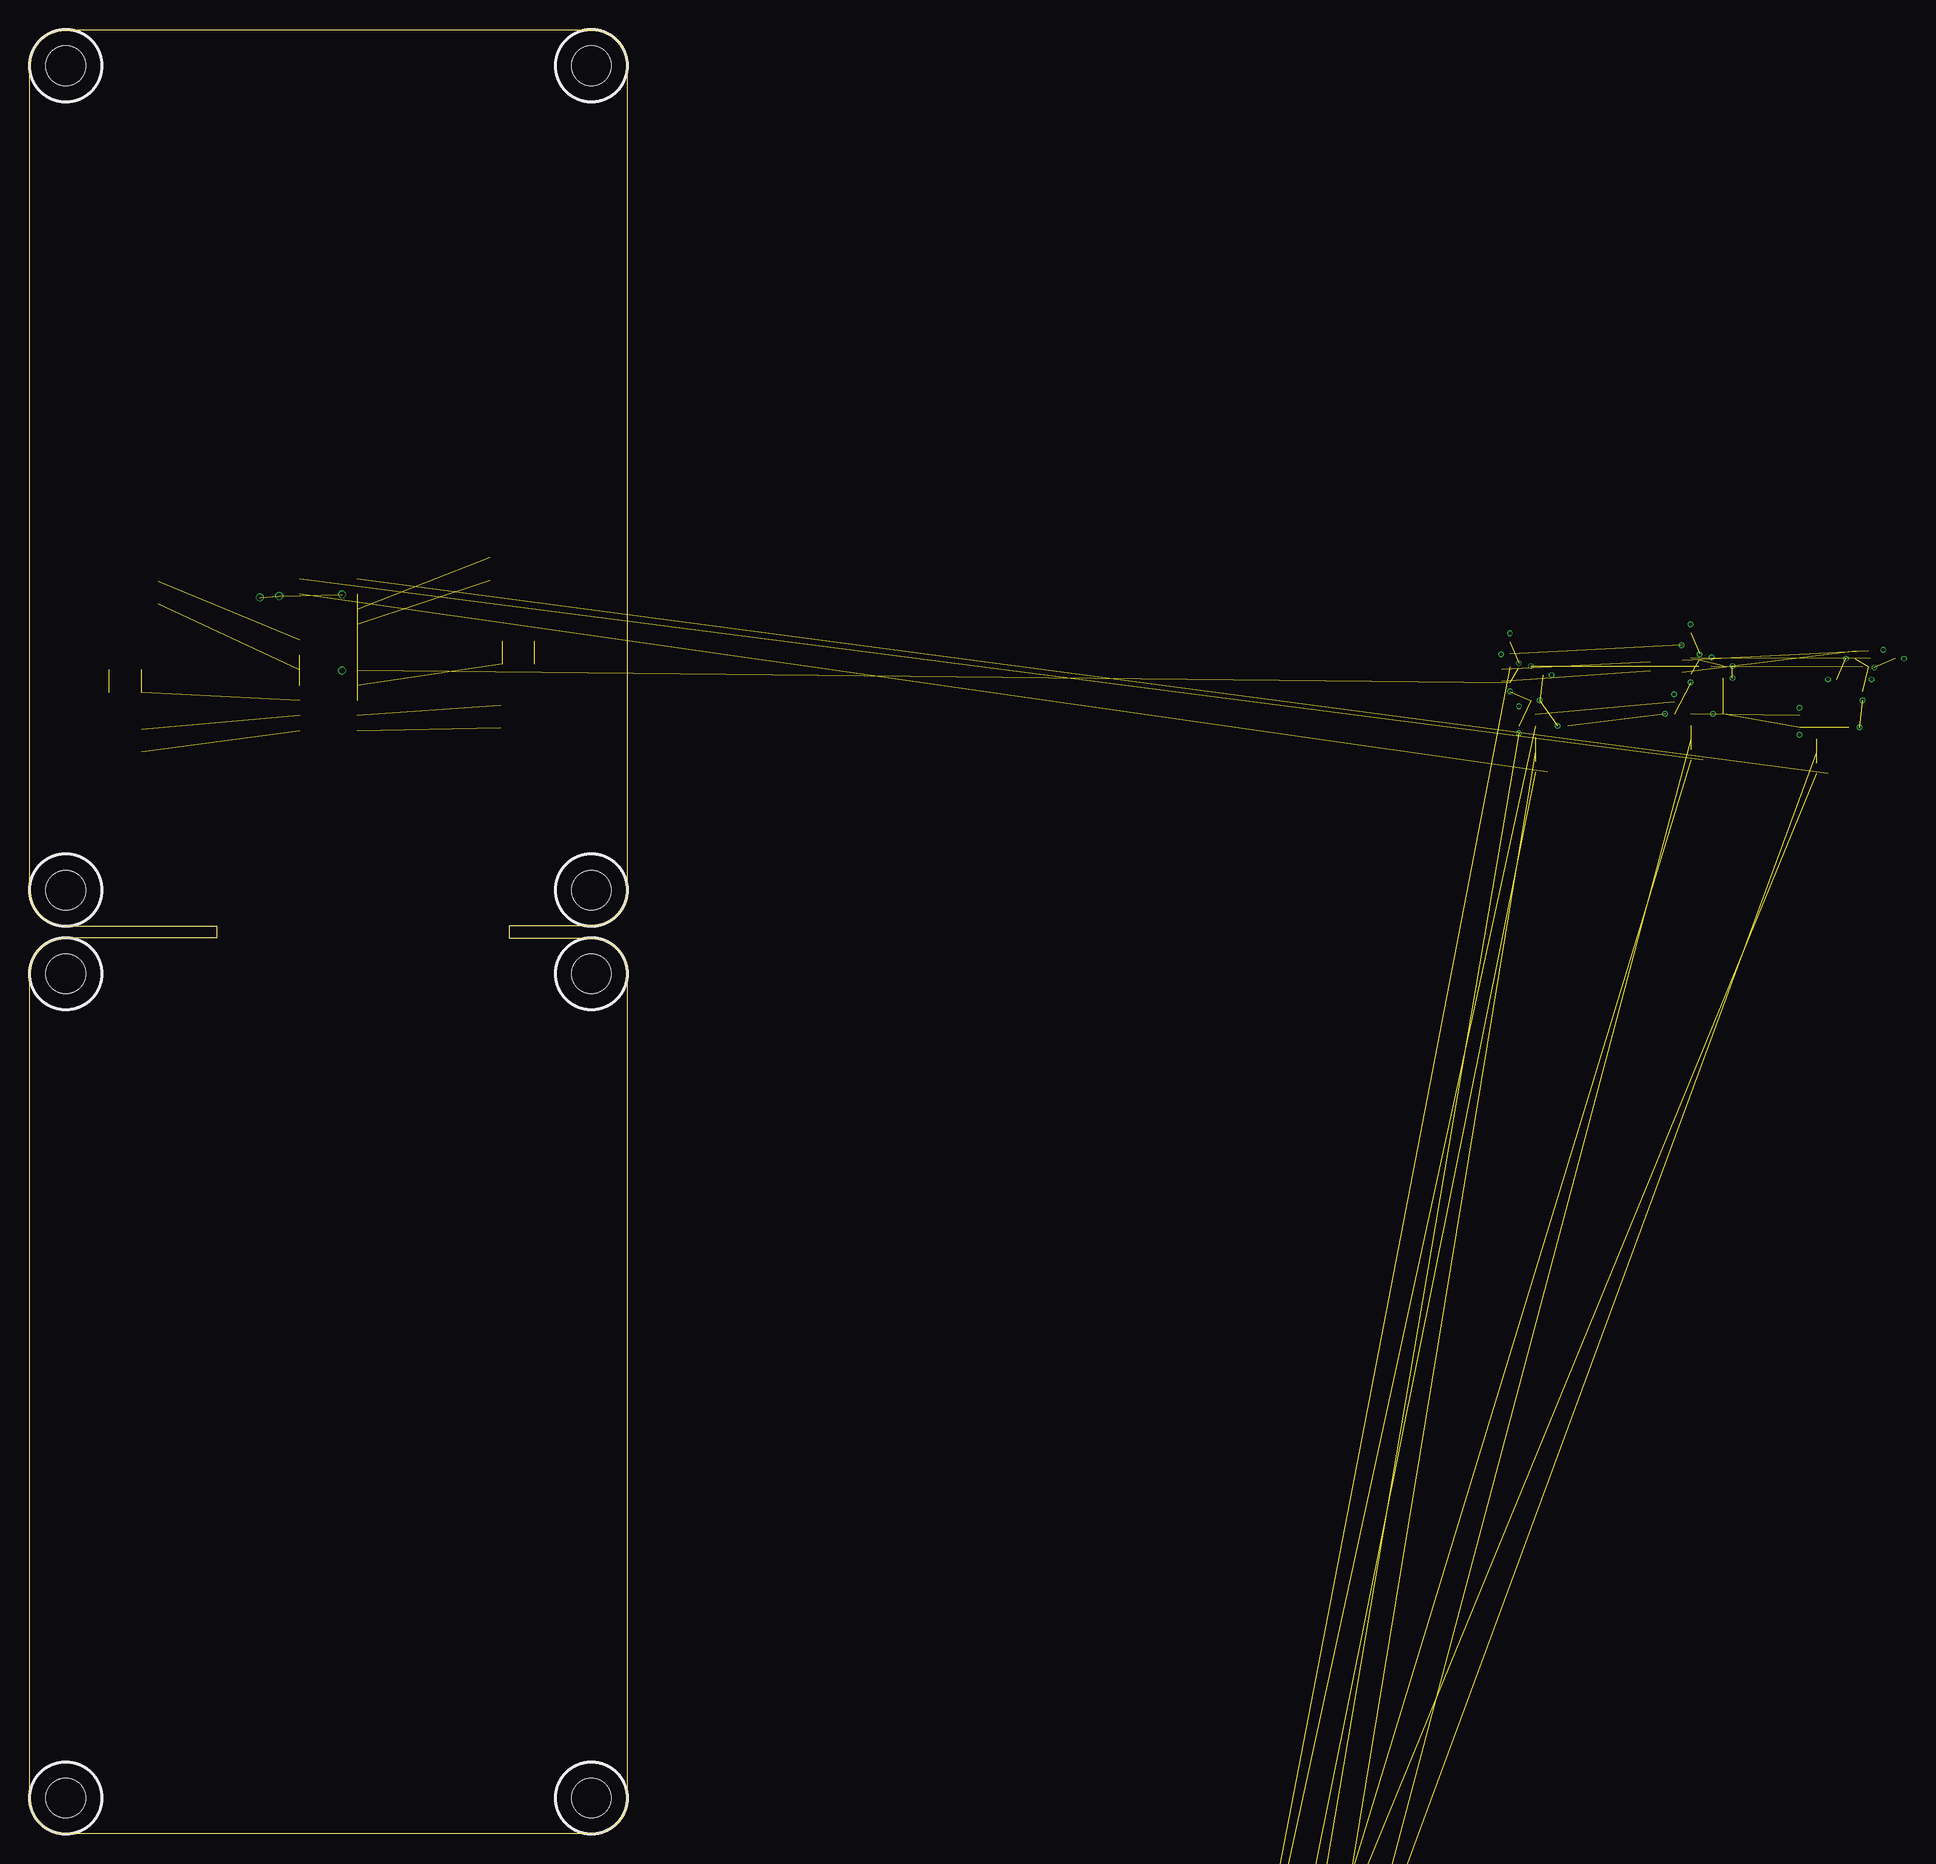
[diagram p11: board, bottom side, seen from below]

Size 50 x 151 mm. Coordinates in mm from the lower left corner, seen from the top.
Outline: 0,72 0,3 arc90 3,0 47,0 arc90 50,3 50,72 arc90 47,75 34.38,75 34.38,76 47,76 arc88 50,79 50,148 arc90 47,151 3,151 arc90 0,148 0,79 arc90 3,76 9.88,76 9.88,75 3,75 arc90 0,72
Copper layers (1*2*3*16): Top 0.035mm / dielectric 0.15mm / GND 0.035mm / dielectric 1.11mm / PWR 0.035mm / dielectric 0.2mm / Bottom 0.035mm
Design rules "myDRC 4 layers 0.15mm": minimum track width 0.15mm, minimum drill 0.25mm, track to track 0.15mm, track to pad 0.15mm, pad to pad 0.15mm, via to via 0.15mm, smd to smd 0mil, copper to edge 0.25mm, drill to drill 0.25mm, minimum pad ring 10mil, minimum via ring 3mil, stop-mask expansion 4mil, vias tented up to drill 1mm, thermal gap 10mil

### Footprints (pad centres in the part's own frame; a part is rotated, then mirrored left to right if it is on the bottom)
0603 = smd 0.8 x 0.8: 1 -0.75,0; 2 0.75,0
1206 = smd 1 x 1.5: 1 1.5,0; 2 -1.5,0
0402 = smd 0.6 x 0.55: 1 -0.5,0; 2 0.5,0
8MM_RADIAL_3.5MM_PITCH = drill 0.7: N 1.75,0 | drill 0.7 square: P -1.75,0
SFV15R-1STE1HLF = smd 0.3 x 1.4: 1 -3.5,-1.875; 2 -3,-1.875; 3 -2.5,-1.875; 4 -2,-1.875; 5 -1.5,-1.875; 6 -1,-1.875; 7 -0.5,-1.875; 8 0,-1.875; 9 0.5,-1.875; 10 1,-1.875; 11 1.5,-1.875; 12 2,-1.875; 13 2.5,-1.875; 14 3,-1.875; 15 3.5,-1.875 | smd 2.65 x 2.3: SH1 -5.275,-0.625; SH2 5.275,-0.625
MOUNTHOLE_6X3 = hole 3.3: 0,0
TO126V = drill 0.8 long: 1 -2.25,0; 2 0,0; 3 2.25,0
TCD2565BFG = smd 1.7 x 0.67: 1 -2.4,6.35; 2 -2.4,5.08; 3 -2.4,3.81; 4 -2.4,2.54; 5 -2.4,1.27; 6 -2.4,0; 7 -2.4,-1.27; 8 -2.4,-2.54; 9 -2.4,-3.81; 10 -2.4,-5.08; 11 -2.4,-6.35; 12 2.4,-6.35; 13 2.4,-5.08; 14 2.4,-3.81; 15 2.4,-2.54; 16 2.4,-1.27; 17 2.4,0; 18 2.4,1.27; 19 2.4,2.54; 20 2.4,3.81; 21 2.4,5.08; 22 2.4,6.35 | smd 0.67 x 1.9: 23 0,19.75; 24 0,-19.75
X2QFN8 = smd 0.55 x 0.25: 1 -0.675,0.5; 3 -0.675,-0.5; 5 0.675,-0.5; 7 0.675,0.5 | smd 0.55 x 0.2: 2 -0.675,0; 6 0.675,0 | smd 0.3 x 0.6: 4 0,-0.65; 8 0,0.65
SOT23-6 = smd 0.6 x 1.1: 1 0.95,1.35; 2 0,1.35; 3 -0.95,1.35; 4 -0.95,-1.35; 5 0,-1.35; 6 0.95,-1.35
MSOP10 = smd 1 x 0.3: 1 -2.5,1; 2 -2.5,0.5; 3 -2.5,0; 4 -2.5,-0.5; 5 -2.5,-1; 6 2.5,-1; 7 2.5,-0.5; 8 2.5,0; 9 2.5,0.5; 10 2.5,1

### Placement (x,y rotation side)
C1  29.12,102 270 top
C2  30.75,102.88 90 top
C3  -103.38,96.12 90 top  (outside the outline)
C4  -105.62,98.38 0 top  (outside the outline)
C5  -101.75,96.62 180 top  (outside the outline)
C6  -98.12,93.12 90 top  (outside the outline)
C7  -100,89.62 180 top  (outside the outline)
C8  -103.75,-80.5 0 top  (outside the outline)
C9  -98.88,-86.88 0 top  (outside the outline)
C10  -105.88,-91.38 0 top  (outside the outline)
C11  -102.38,-91.38 0 top  (outside the outline)
C18  -91.25,97.75 0 top  (outside the outline)
C19  -89,100 270 top  (outside the outline)
C20  -91.25,96.75 0 top  (outside the outline)
C21  -87.62,94.25 90 top  (outside the outline)
C22  -89.5,90.75 180 top  (outside the outline)
C23  -76.12,97 0 top  (outside the outline)
C24  -73.88,99.25 270 top  (outside the outline)
C25  -75.62,95.38 90 top  (outside the outline)
C34  -74.62,93.25 90 top  (outside the outline)
C38  -76.5,89.75 180 top  (outside the outline)
C52  -52.38,-40.75 0 top  (outside the outline)
C53  -52.38,-43 0 top  (outside the outline)
C54  -52.38,-49.25 0 top  (outside the outline)
C55  -49.88,-49.25 0 top  (outside the outline)
C56  -52.38,-55.5 0 top  (outside the outline)
C57  -49.88,-55.5 0 top  (outside the outline)
C58  -51.75,-58.75 0 top  (outside the outline)
C59  -51.75,-62 0 top  (outside the outline)
C60  -51.75,-65.25 0 top  (outside the outline)
C61  -51.75,-68.5 0 top  (outside the outline)
C62  -51.75,-71.75 0 top  (outside the outline)
C63  -51.75,-75 0 top  (outside the outline)
CN3  38.5,116.5 0 top
FB1  32.75,102.88 90 top
FB2  -98.88,-91.38 0 top  (outside the outline)
MECH1  3,3 0 top
MECH2  47,3 180 bottom
MECH3  3,72 0 top
MECH4  47,72 0 top
MECH5  6mm x 3mm  [MOUNTHOLE_6X3]  47,148 180 top
MECH6  6mm x 3mm  [MOUNTHOLE_6X3]  3,148 0 bottom
MECH7  6mm x 3mm  [MOUNTHOLE_6X3]  47,79 180 top
MECH8  6mm x 3mm  [MOUNTHOLE_6X3]  3,79 180 top
Q2  -104.5,-86.12 0 top  (outside the outline)
R1  -102.25,95.25 90 top  (outside the outline)
R2  -100,88.75 0 top  (outside the outline)
R3  -105.88,-94.62 0 top  (outside the outline)
R4  -100,90.5 180 top  (outside the outline)
R5  -91.25,95.88 0 top  (outside the outline)
R6  -89.5,89.88 0 top  (outside the outline)
R7  -89.5,91.62 180 top  (outside the outline)
R8  -77,95.88 0 top  (outside the outline)
R9  -76.5,88.88 0 top  (outside the outline)
R10  -76.5,90.62 180 top  (outside the outline)
R11  -102.38,-94.62 0 top  (outside the outline)
U1  25,98.67 0 top
U3  -103.38,98.38 270 top  (outside the outline)
U6  -100.88,92.62 90 top  (outside the outline)
U7  -89,97.75 180 top  (outside the outline)
U8  -90.38,93.75 90 top  (outside the outline)
U9  -73.88,97 180 top  (outside the outline)
U10  -77.38,92.75 90 top  (outside the outline)
U11  9.12,98.88 90 top
U12  42,96.5 270 top
U13  10.12,105.88 90 top
U14  40.62,103.88 270 top
U15  9.25,93.5 90 top
U19  -50.12,-46.38 0 top  (outside the outline)
U20  42,91.5 270 top
U21  -50.12,-37.88 0 top  (outside the outline)
U22  -50.12,-52.62 0 top  (outside the outline)

### Tracks (layer width: path | path; a pad name or v marks a point on that pad's centre or on a via)
ADC_OS1_SPI_MISO
  Top 0.15: U9.2 -70.5,97
ADC_OS2_SPI_MISO
  Top 0.15: U7.2 -85.62,97.75
ADC_OS3_SPI_MISO
  Top 0.15: U3.2 -103.38,101.75
ADC_SPI_NCS  (2 unrouted)
  Top 0.15: U9.1 -72.45,96.5 -72.33,96.62 -70.5,96.62 | U7.1 -87.58,97.25 -87.45,97.38 -85.62,97.38 | U3.1 -102.88,99.8 -103,99.92 -103,101.75
ADC_SPI_SCLK  (2 unrouted)
  Top 0.15: U3.3 -103.88,99.75 -103.75,99.88 -103.75,101.75 | U7.3 -87.62,98.25 -87.5,98.12 -85.62,98.12 | U9.3 -72.5,97.5 -72.38,97.38 -70.5,97.38
CCD_1A  (3 unrouted)
  Top 0.5: U1.8 U1.15
CCD_2A  (4 unrouted)
  Top 0.5: U1.9 U1.14
CCD_CP  (1 unrouted)
CCD_RS  (1 unrouted)
CCD_SH1  (1 unrouted)
CCD_SH2A  (1 unrouted)
CCD_SH2B  (1 unrouted)
CCD_SH3  (1 unrouted)
CCD_SW  (1 unrouted)
CCD_TG  (1 unrouted)
GND  (via drill 0.3, 0.5)  (48 unrouted)
  Top 0.15: C4.1 v-106.88,98.38 | U3.5 -104.3,97.7 v-104.38,97.62 | C3.1 v-103.38,94.88 | C5.1 v-100.5,96.62 | U3.8 v-102,98.38 | U6.2 v-103.12,92.62 | C6.1 v-98.12,92 | C19.1 v-89,101.25 | U7.5 -89.67,98.67 v-89.75,98.75 | C18.1 v-92.5,97.75 | C20.1 v-92.5,96.75 | U7.8 v-89,96.38 | U8.2 v-90.88,93.75 | C21.1 v-86.88,93.75 | C24.1 v-73.88,100.5 | U9.5 -74.55,97.92 v-74.62,98 | C23.1 v-77.38,97 | C25.1 v-76.38,94.88 | U9.8 v-73.88,95.62 | U10.2 v-77.88,92.75 | C34.1 v-74.62,92.12
  Top 0.5: U1.7 23.22,97.41 23.24,97.36 23.25,97.38 v23.88,97.38 | U1.2 23.23,103.75 23.24,103.74 23.25,103.75 v23.88,103.75 | C1.1 v29.12,103.62 | C2.1 v30.75,103.5
  pour GND: -25,0 75,0 75,50 -25,50
N$1
  Top 0.5: U1.20 U1.19 29.12,101.22 29.14,101.25 C1.2 30.62,101.25 C2.2 FB1.2
N$2
  Top 0.15: R1.2 C5.2 -102.88,97.25 U3.7
N$3  (4 unrouted)
N$4  (3 unrouted)
N$5
  Top 0.15: R1.1 -102.22,94.72 U6.1 -101.95,93.58 -100.5,92.12 R4.2 C7.2
N$6  (2 unrouted)
  Top 0.15: -99.5,91.65 U6.4 | R2.2 C7.1
N$7  (1 unrouted)
N$9  (1 unrouted)
N$10  (1 unrouted)
N$11  (1 unrouted)
N$12  (1 unrouted)
N$14  (2 unrouted)
  Top 0.15: -76,91.78 U10.4 | R9.2 C38.1
N$19
  Top 0.15: -90.12,97.25 -89.75,97.25 U7.7
  Top 0.152: R5.2 C20.2 -90.25,97.25 -89.75,97.25
N$20
  Top 0.15: U8.1 -90.95,94.7 -90,93.75 R7.2 C22.2
  Top 0.152: U8.1 -91.75,94.72 R5.1
N$21  (2 unrouted)
  Top 0.15: -89,92.78 U8.4 | R6.2 C22.1
N$22
  Top 0.15: R8.2 C25.2 -75,96.5 U9.7
N$23
  Top 0.15: -77.53,95.85 R8.1 | U10.1 -77.95,93.7 -77,92.75 R10.2 C38.2
  Top 0.152: U10.1 -78.72,94.65 -77.53,95.85
POT_I2C_SCL  (2 unrouted)
POT_I2C_SDA  (2 unrouted)
PWR_ANA_3V3  (via drill 0.3)  (2 unrouted)
  Top 0.15: U3.6 C3.2 v-104.12,96.62 | U7.6 C18.2 v-90.75,98.5 | U9.6 C23.2 v-75.62,97.75
PWR_ANA_5V  (via drill 0.3)  (8 unrouted)
  Top 0.15: U6.5 U6.6 -99.47,93.62 C6.2 v-98.12,94.25 | U8.5 U8.6 -88.97,94.75 C21.2 v-87.62,95.38 | U10.5 U10.6 -75.97,93.75 C34.2 v-74.62,94.38
PWR_SENS_UNREG  (1 unrouted)
PWR_SYS_3V3  (via drill 0.3)  (10 unrouted)
  Top 0.15: U3.4 C4.2 v-105.12,99.12 | U7.4 C19.2 v-88.25,99.5 | U9.4 C24.2 v-73.12,98.75
  pour PWR (rank 6): -25,0 75,0 75,50 -25,50
SEN_SIG_OS1  (1 unrouted)
SEN_SIG_OS2  (1 unrouted)
SEN_SIG_OS3  (1 unrouted)